# EAGLE design module (EAGLE 7.2.0)
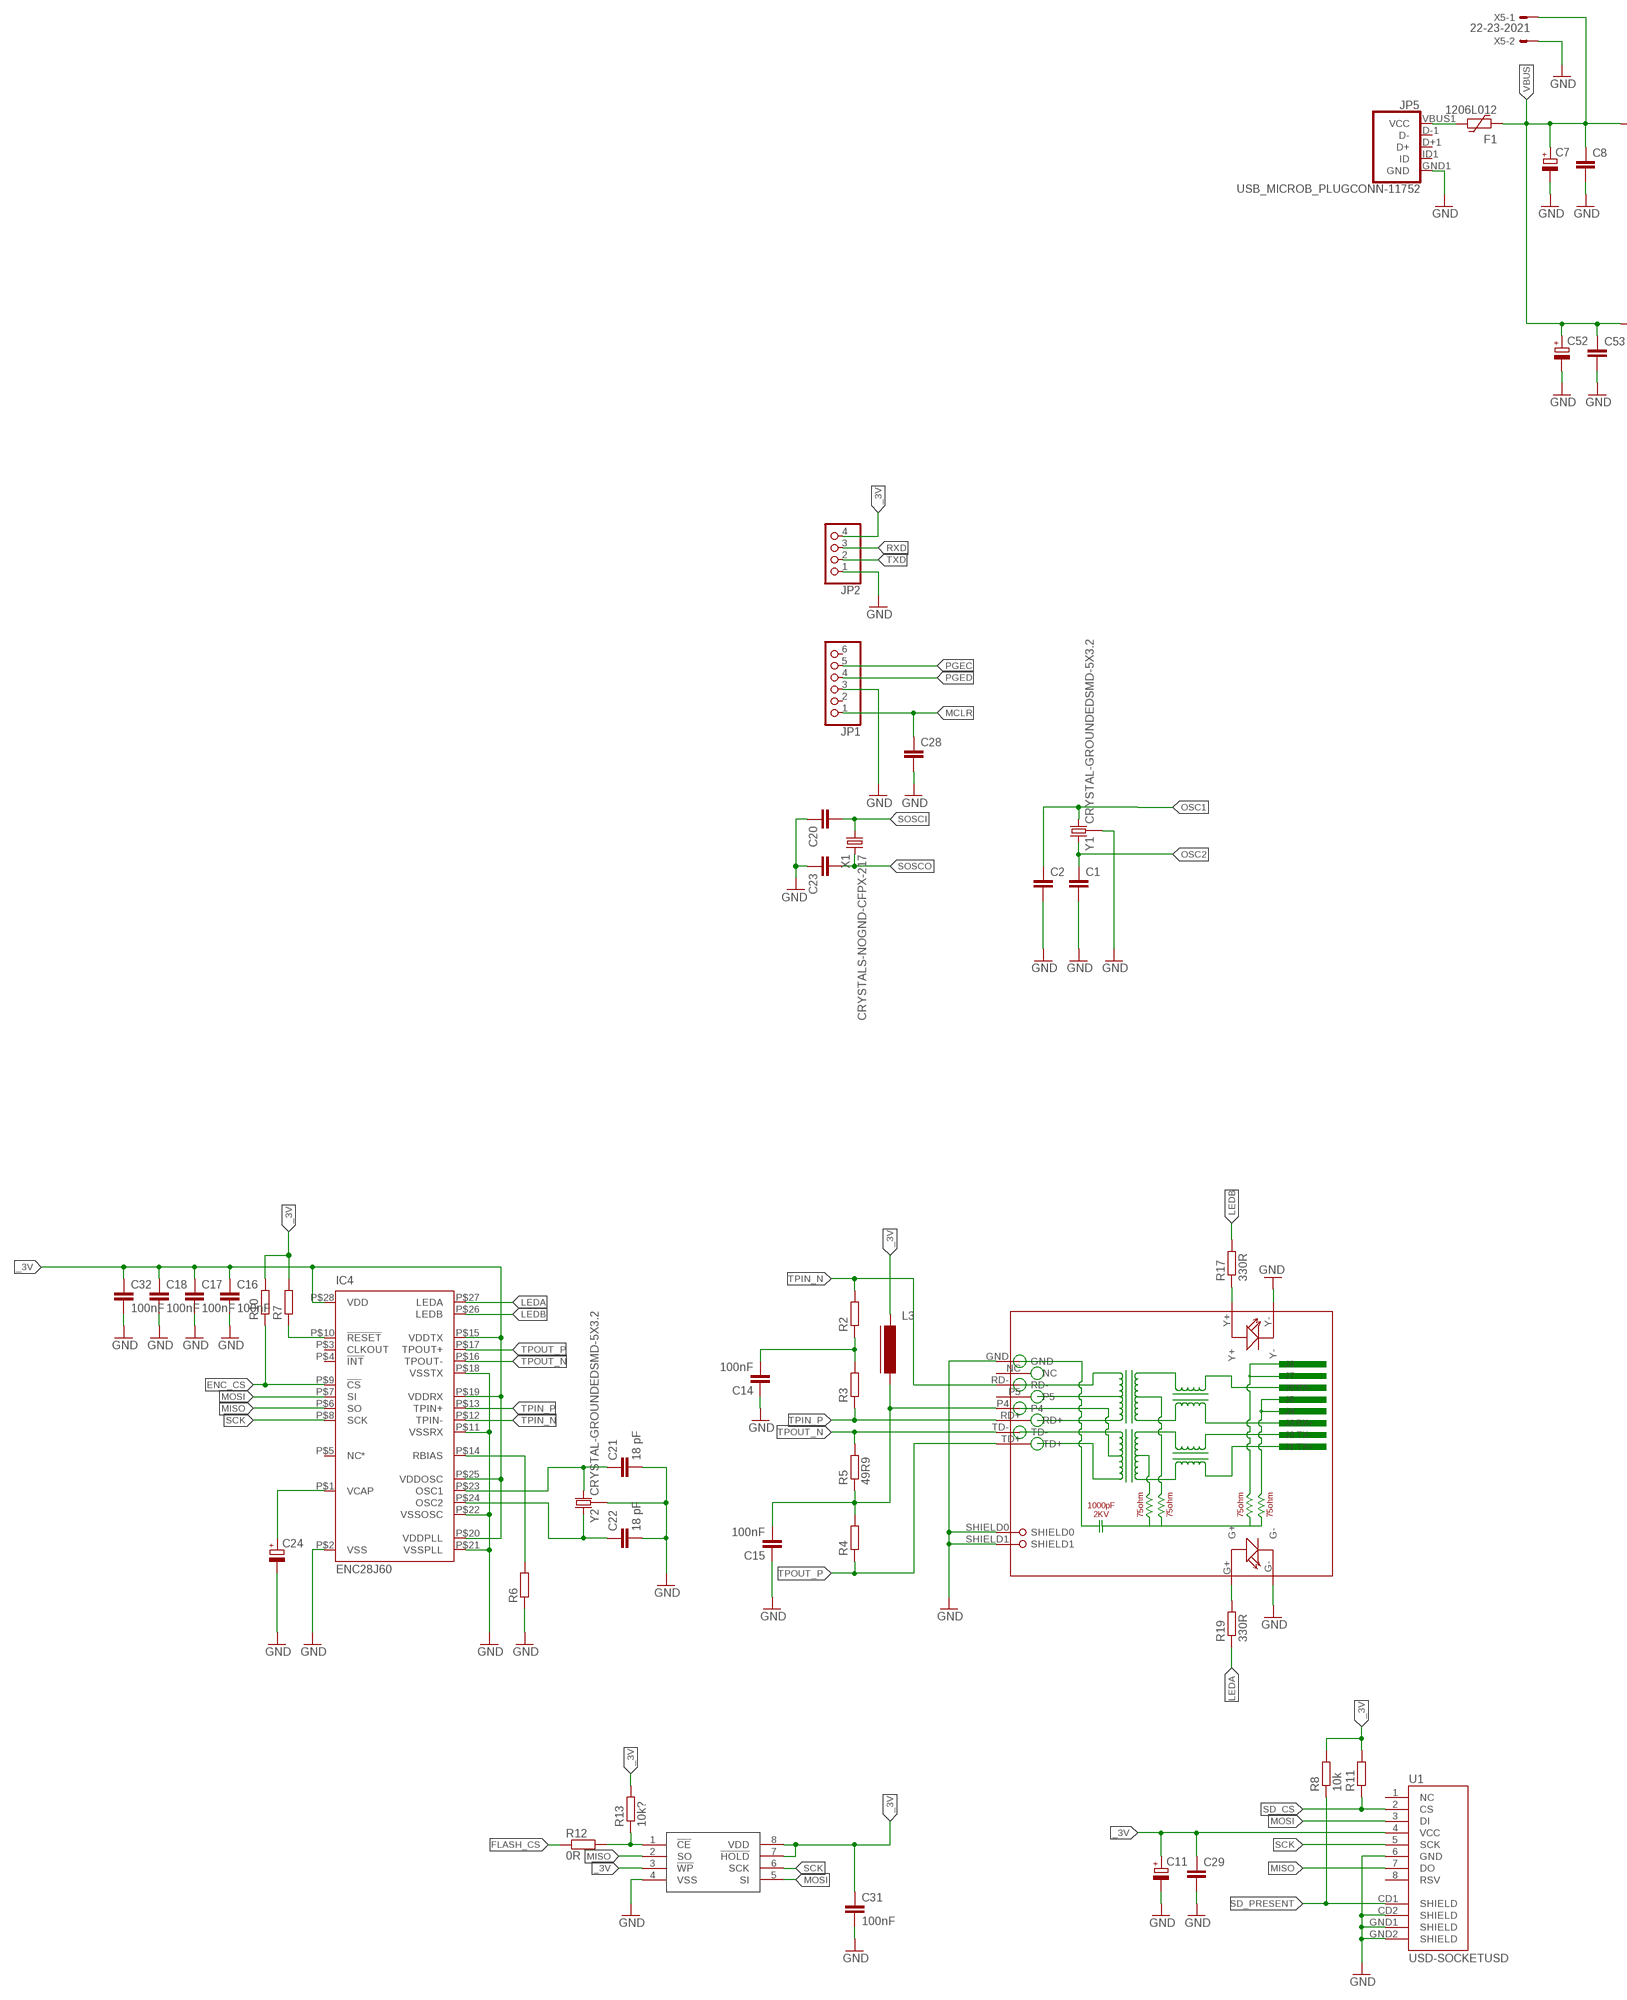
[diagram p0: schematic, sheet 1, part 1 of 3]
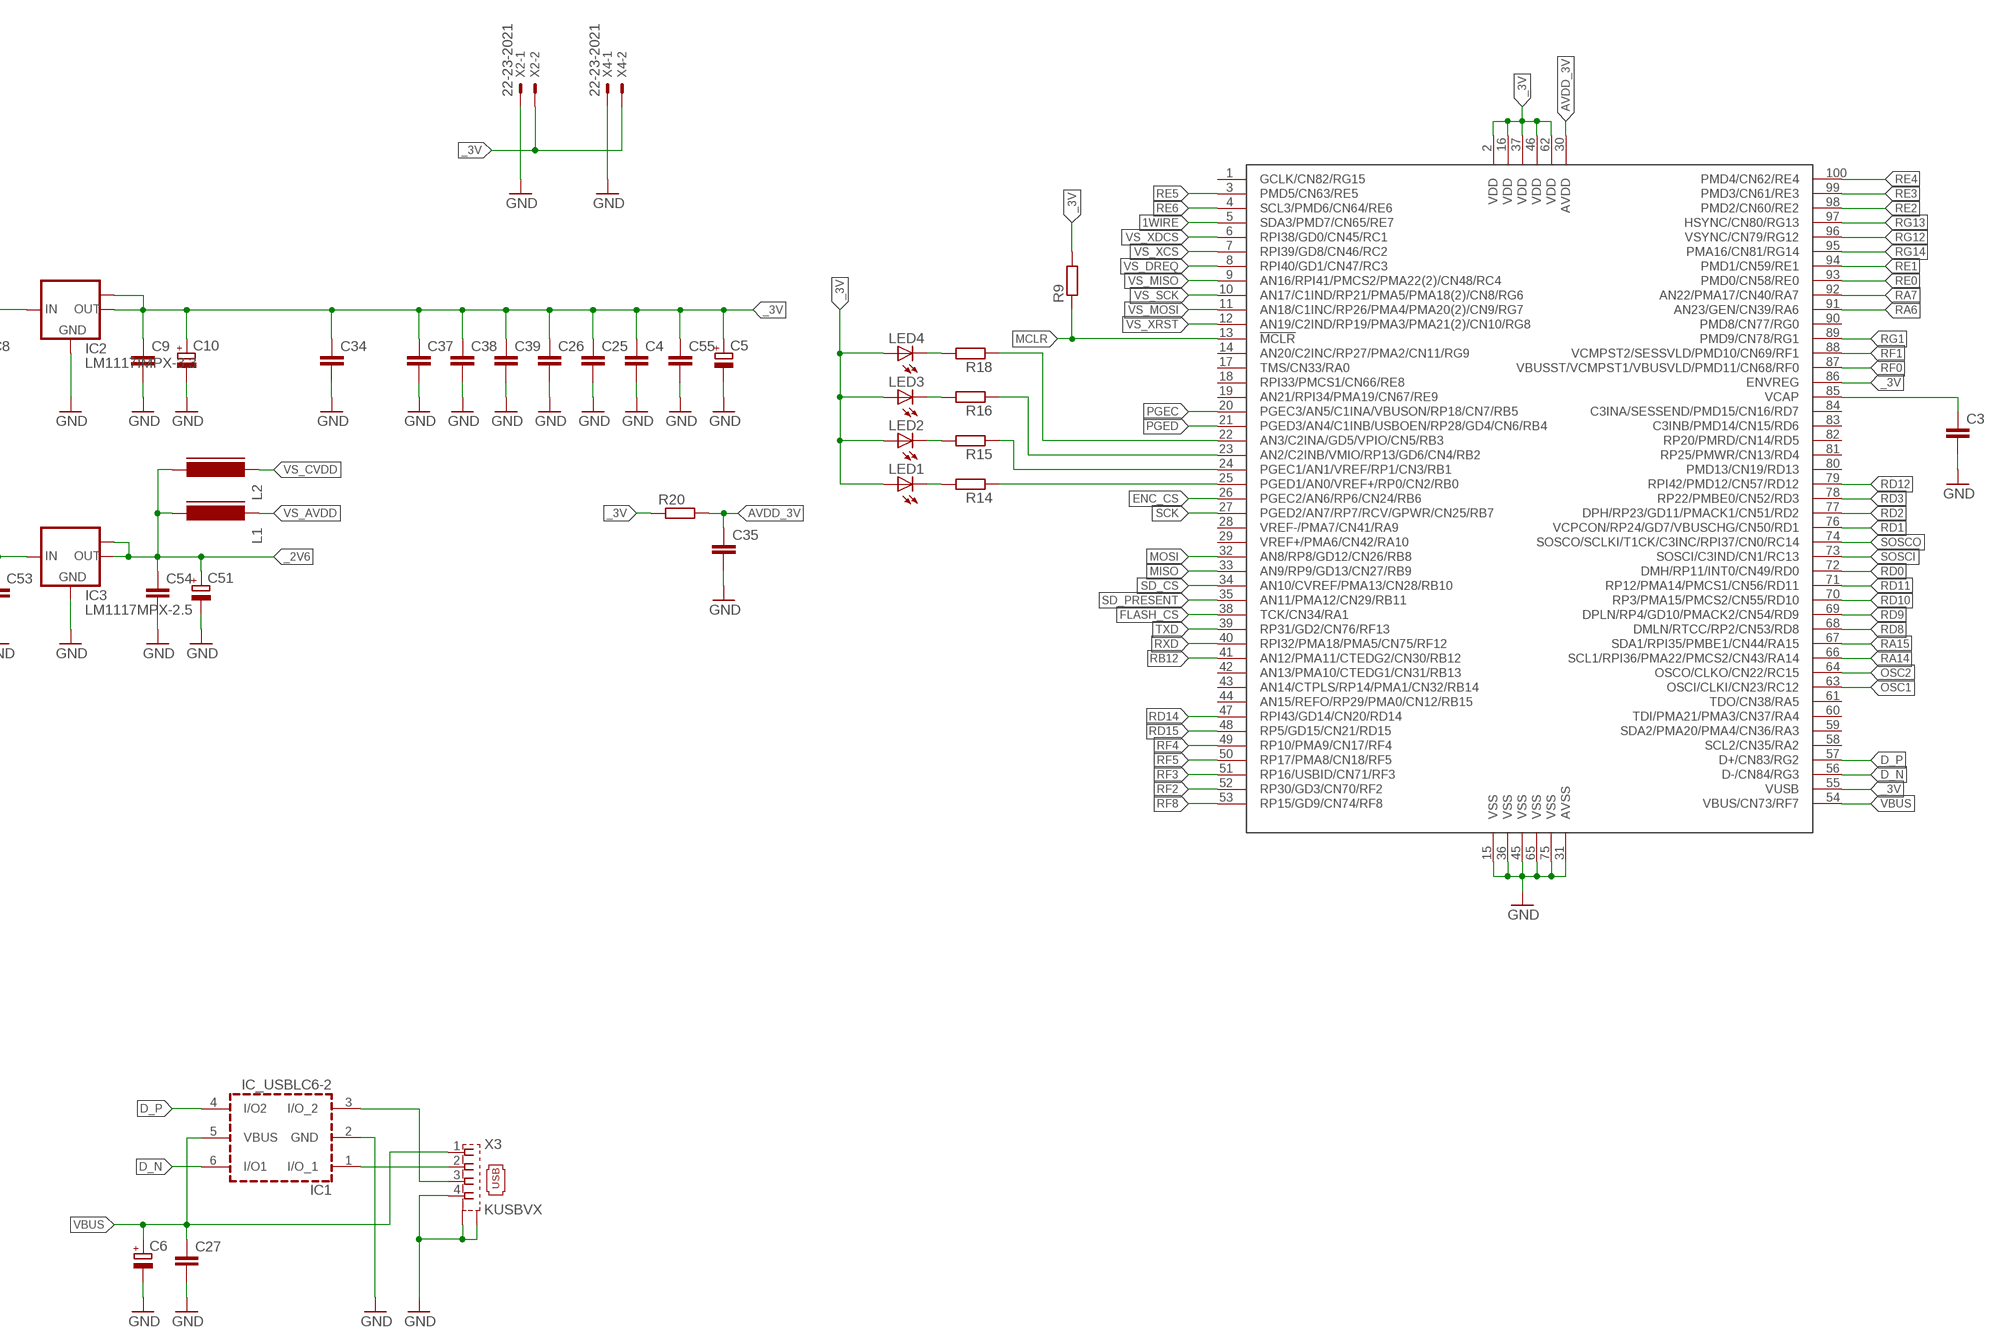
[diagram p1: schematic, sheet 1, part 2 of 3]
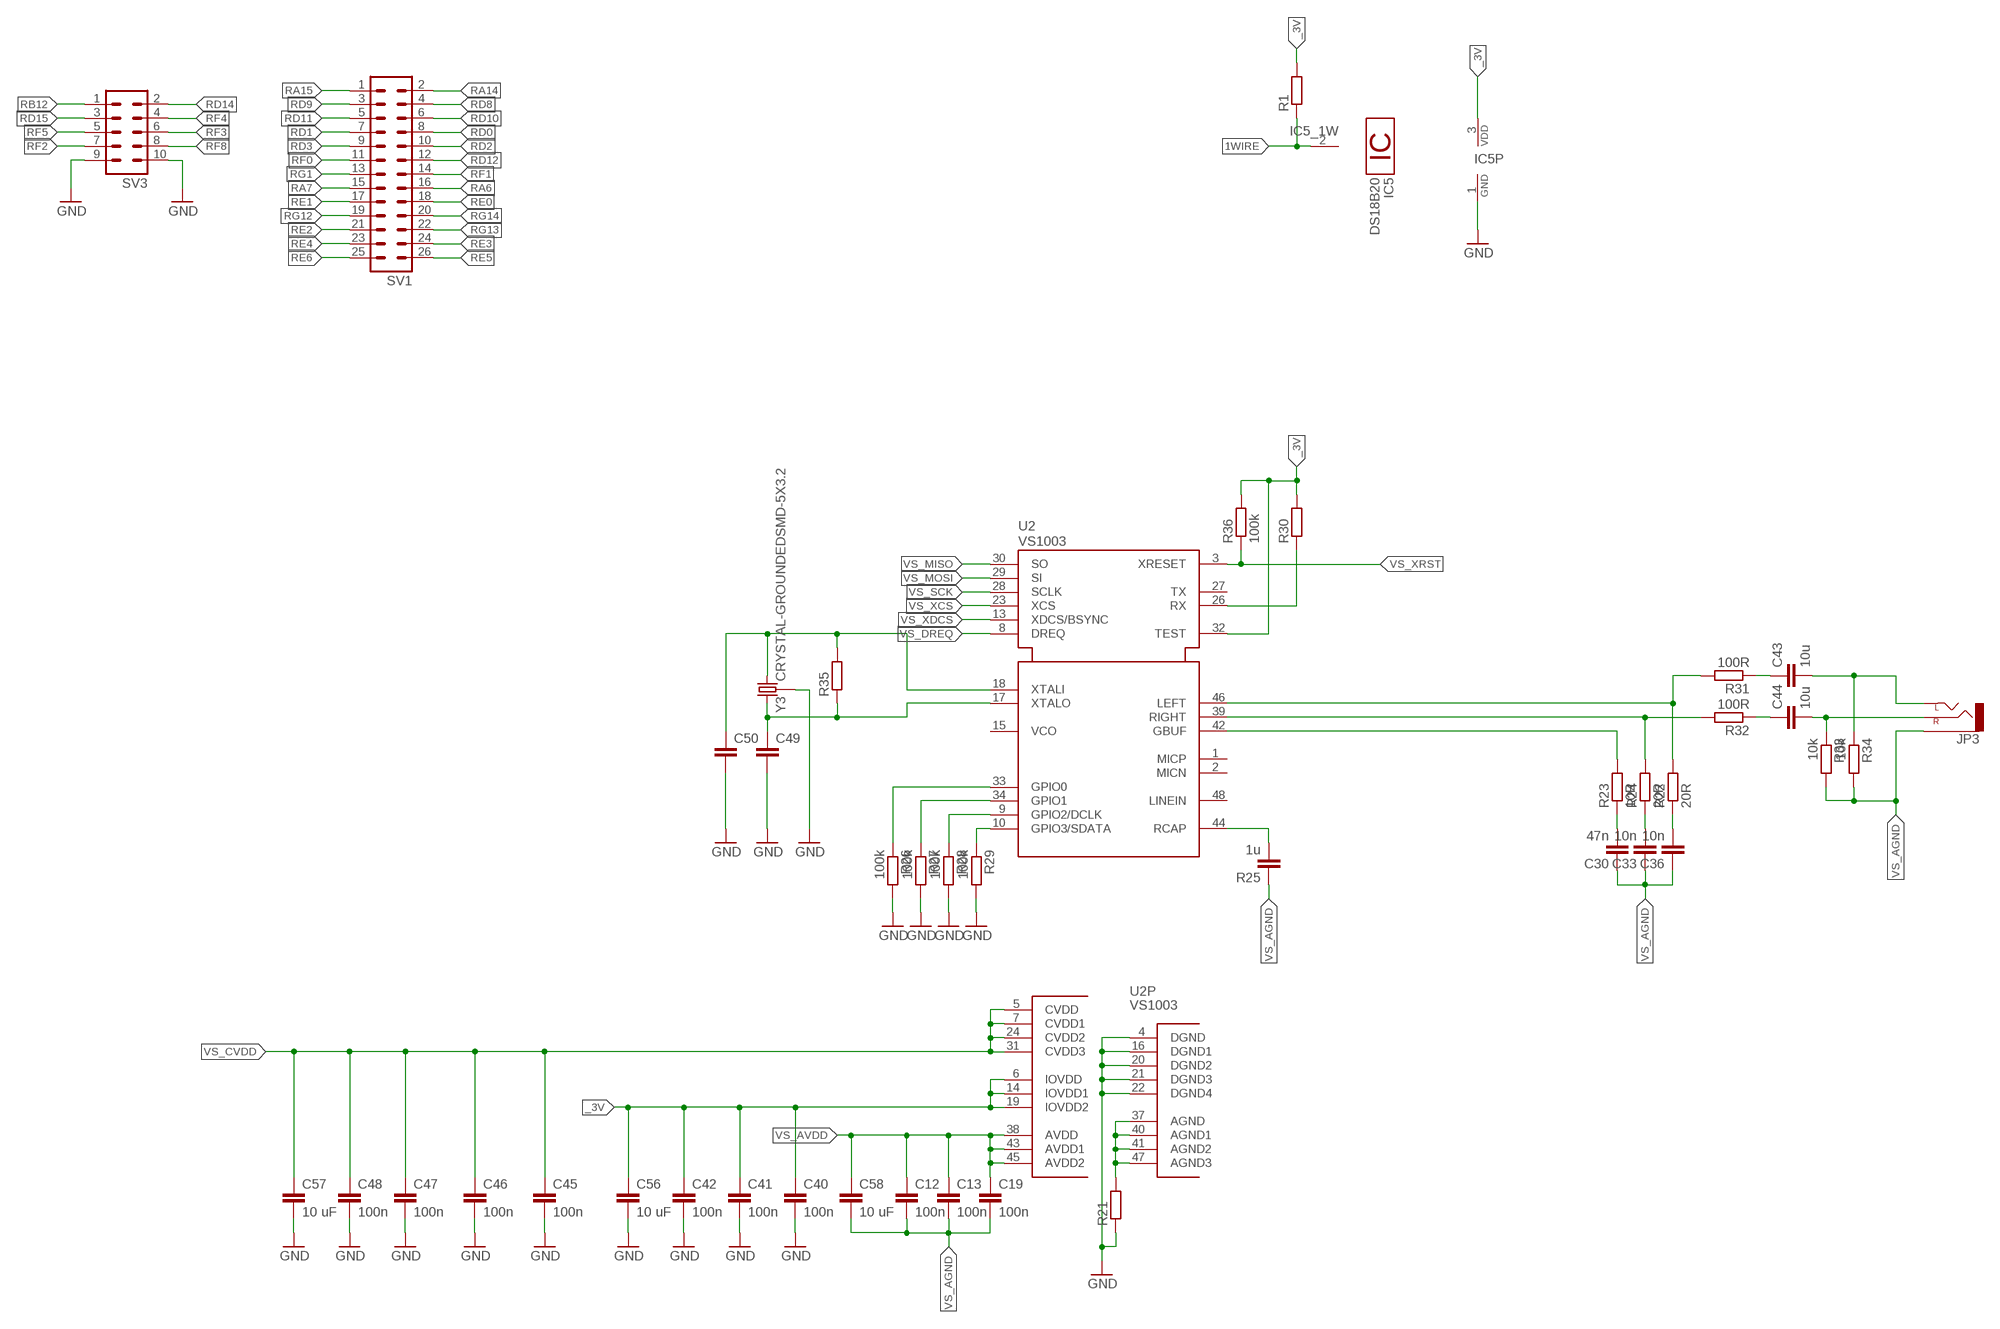
[diagram p2: schematic, sheet 1, part 3 of 3]

## Parts
C1  C-EUC0603  [C0603]
C2  C-EUC0603  [C0603]
C3  C-EUC0603  [C0603]
C4  C-EUC0402  [C0402]
C5  CPOL-EUSMCA  [SMC_A]
C6  CPOL-EUSMCB  [SMC_B]
C7  CPOL-EUSMCB  [SMC_B]
C8  C-EUC0603  [C0603]
C9  C-EUC0603  [C0603]
C10  CPOL-EUSMCB  [SMC_B]
C11  CPOL-EUSMCA  [SMC_A]
C12  100n  C-EUC0603  [C0603]
C13  100n  C-EUC0603  [C0603]
C14  100nF  C-EUC0603  [C0603]
C15  100nF  C-EUC0603  [C0603]
C16  100nF  C-EUC0402  [C0402]
C17  100nF  C-EUC0603  [C0603]
C18  100nF  C-EUC0603  [C0603]
C19  100n  C-EUC0603  [C0603]
C20  C-EUC0603  [C0603]
C21  18 pF  C-EUC0603  [C0603]
C22  18 pF  C-EUC0603  [C0603]
C23  C-EUC0603  [C0603]
C24  CPOL-EUSMCA  [SMC_A]
C25  C-EUC0402  [C0402]
C26  C-EUC0402  [C0402]
C27  C-EUC0805  [C0805]
C28  C-EUC0603  [C0603]
C29  C-EUC0603  [C0603]
C30  47n  C-EUC0603  [C0603]
C31  100nF  C-EUC0603  [C0603]
C32  100nF  C-EUC0402  [C0402]
C33  10n  C-EUC0603  [C0603]
C34  C-EUC0402  [C0402]
C35  C-EUC0402  [C0402]
C36  10n  C-EUC0603  [C0603]
C37  C-EUC0402  [C0402]
C38  C-EUC0603  [C0603]
C39  C-EUC0402  [C0402]
C40  100n  C-EUC0402  [C0402]
C41  100n  C-EUC0402  [C0402]
C42  100n  C-EUC0402  [C0402]
C43  10u  C-EUC0603  [C0603]
C44  10u  C-EUC0603  [C0603]
C45  100n  C-EUC0402  [C0402]
C46  100n  C-EUC0603  [C0603]
C47  100n  C-EUC0603  [C0603]
C48  100n  C-EUC0603  [C0603]
C49  C-EUC0603  [C0603]
C50  C-EUC0603  [C0603]
C51  CPOL-EUSMCC  [SMC_C]
C52  CPOL-EUSMCC  [SMC_C]
C53  C-EUC1206  [C1206]
C54  C-EUC1206  [C1206]
C55  C-EUC0603  [C0603]
C56  10 uF  C-EUC0603  [C0603]
C57  10 uF  C-EUC0603  [C0603]
C58  10 uF  C-EUC0603  [C0603]
F1  1206L012  [1206L]
IC1  IC_USBLC6-2  [SOT-23-6L]
IC2  LM1117IMPX-3.3  [SOT223]
IC3  LM1117MPX-2.5  [SOT223]
IC4  ENC28J60  [TSSOP28W]
IC5  DS18B20  [TO92-]
JP1  PINHD-1X6  [1X06]
JP2  PINHD-1X4  [1X04]
JP3  AUDIO-JACKAUDIO_JACK2  [AUDIO-JACK2]
JP5  USB_MICROB_PLUGCONN-11752  [USB-B-MICRO-SMD_V03]
L1  FERRITE-0805  [FB805]
L2  FERRITE-0805  [FB805]
L3  FERRITE-0805  [FB805]
LED1  LEDCHIP-LED0603  [CHIP-LED0603]
LED2  LEDCHIP-LED0603  [CHIP-LED0603]
LED3  LEDCHIP-LED0603  [CHIP-LED0603]
LED4  LEDCHIP-LED0603  [CHIP-LED0603]
R1  R-EU_R0603  [R0603]
R2  R-EU_R0603  [R0603]
R3  R-EU_R0603  [R0603]
R4  R-EU_R0603  [R0603]
R5  49R9  R-EU_R0603  [R0603]
R6  R-EU_R0805  [R0805]
R7  R-EU_R0603  [R0603]
R8  10k  R-EU_R0603  [R0603]
R9  R-EU_R0603  [R0603]
R10  R-EU_R0603  [R0603]
R11  R-EU_R0603  [R0603]
R12  0R  R-EU_R0603  [R0603]
R13  10k?  R-EU_R0603  [R0603]
R14  R-EU_R0603  [R0603]
R15  R-EU_R0603  [R0603]
R16  R-EU_R0603  [R0603]
R17  330R  R-EU_R1206  [R1206]
R18  R-EU_R0603  [R0603]
R19  330R  R-EU_R1206  [R1206]
R20  R-EU_R0805  [R0805]
R21  R-EU_R0603  [R0603]
R22  20R  R-EU_R0603  [R0603]
R23  10R  R-EU_R0603  [R0603]
R24  20R  R-EU_R0603  [R0603]
R25  1u  C-EUC0603  [C0603]
R26  100k  R-EU_R0402  [R0402]
R27  100k  R-EU_R0402  [R0402]
R28  100k  R-EU_R0402  [R0402]
R29  100k  R-EU_R0402  [R0402]
R30  R-EU_0204/7  [0204/7]
R31  100R  R-EU_R0603  [R0603]
R32  100R  R-EU_R0603  [R0603]
R33  10k  R-EU_R0603  [R0603]
R34  10k  R-EU_R0603  [R0603]
R35  R-EU_R0603  [R0603]
R36  100k  R-EU_R0603  [R0603]
RJ1  HR911105A  [HR911105A]
SV1  ML26L  [ML26L]
SV3  ML10L  [ML10L]
U1  USD-SOCKETUSD  [USD-SOCKET-PP]
U2  VS1003  [LQFP48]
U$1  PIC24FJ256DA210SMALL  [TQFP100-12X12]
U$2  SST25VF016BSO8M  [SO-08M]
X1  CRYSTALS-NOGND-CFPX-217  [3.2X1.5-2-PAD]
X2  22-23-2021  [22-23-2021]
X3  KUSBVX  [KUSBVX]
X4  22-23-2021  [22-23-2021]
X5  22-23-2021  [22-23-2021]
Y1  CRYSTAL-GROUNDEDSMD-5X3.2  [CRYSTAL-SMD-5X3.2-4PAD]
Y2  CRYSTAL-GROUNDEDSMD-5X3.2  [CRYSTAL-SMD-5X3.2-4PAD]
Y3  CRYSTAL-GROUNDEDSMD-5X3.2  [CRYSTAL-SMD-5X3.2-4PAD]

## Nets
1WIRE: IC5.2 R1.1 U$1.5(SDA3/PMD7/CN65/RE7)
_2V6: C51.+ C54.1 IC3.2(OUT) IC3.TAB(OUT1) L1.2 L2.2
_3V: C4.1 C5.+ C9.1 C10.+ C11.+ C16.1 C17.1 C18.1 C25.1 C26.1 C29.1 C31.1 C32.1 C34.1 C37.1 C38.1 C39.1 C40.1 C41.1 C42.1 C55.1 C56.1 IC2.2(OUT) IC2.TAB(OUT1) IC4.P$15(VDDTX) IC4.P$19(VDDRX) IC4.P$20(VDDPLL) IC4.P$25(VDDOSC) IC4.P$28(VDD) IC5.3 JP2.4 L3.1 LED1.A LED2.A LED3.A LED4.A R1.2 R7.2 R8.2 R9.2 R10.2 R11.2 R13.2 R20.1 R30.2 R36.2 U1.4(VCC) U2.6(IOVDD) U2.14(IOVDD1) U2.19(IOVDD2) U2.32(TEST) U$1.2(VDD) U$1.16(VDD) U$1.37(VDD) U$1.46(VDD) U$1.55(VUSB) U$1.62(VDD) U$1.86(ENVREG) U$2.3(!WP) U$2.7(!HOLD) U$2.8(VDD) X2.2 X4.2
AVDD_3V: C35.1 R20.2 U$1.30(AVDD)
CE1: R12.2 R13.1 U$2.1(!CE)
D2_N: IC1.1(I/O_1) X3.2
D2_P: IC1.3(I/O_2) X3.3
D_N: IC1.6(I/O1) U$1.56(D-/CN84/RG3)
D_P: IC1.4(I/O2) U$1.57(D+/CN83/RG2)
ENC_CS: IC4.P$9(!CS) R10.1 U$1.26(PGEC2/AN6/RP6/CN24/RB6)
ENC_RST: IC4.P$10(!RESET) R7.1
FLASH_CS: R12.1 U$1.38(TCK/CN34/RA1)
GND: C1.2 C2.2 C3.2 C4.2 C5.- C6.- C7.- C8.2 C9.2 C10.- C11.- C14.1 C15.1 C16.2 C17.2 C18.2 C20.1 C21.2 C22.2 C23.1 C24.- C25.2 C26.2 C27.2 C28.2 C29.2 C31.2 C32.2 C34.2 C35.2 C37.2 C38.2 C39.2 C40.2 C41.2 C42.2 C45.2 C46.2 C47.2 C48.2 C49.2 C50.2 C51.- C52.- C53.2 C54.2 C55.2 C56.2 C57.2 IC1.2(GND) IC2.1(GND) IC3.1(GND) IC4.P$2(VSS) IC4.P$11(VSSRX) IC4.P$18(VSSTX) IC4.P$21(VSSPLL) IC4.P$22(VSSOSC) IC5.1 JP1.3 JP2.1 JP5.GND1(GND) R6.1 R21.1 R26.2 R27.2 R28.2 R29.2 RJ1.G- RJ1.GND RJ1.SHIELD0 RJ1.SHIELD1 RJ1.Y- SV3.9 SV3.10 U1.6(GND) U1.CD2(SHIELD) U1.GND1(SHIELD) U1.GND2(SHIELD) U2.4(DGND) U2.16(DGND1) U2.20(DGND2) U2.21(DGND3) U2.22(DGND4) U$1.15(VSS) U$1.31(AVSS) U$1.36(VSS) U$1.45(VSS) U$1.65(VSS) U$1.75(VSS) U$2.4(VSS) X2.1 X3.4 X3.M1(S1) X3.M2(S2) X4.1 X5.2 Y1.2 Y1.4 Y2.2 Y2.4 Y3.2 Y3.4
LEDA: IC4.P$27(LEDA) R19.1
LEDB: IC4.P$26(LEDB) R17.2
MCLR: C28.1 JP1.1 R9.1 U$1.13(!MCLR)
MISO: IC4.P$6(SO) U1.7(DO) U$1.33(AN9/RP9/GD13/CN27/RB9) U$2.2(SO)
MOSI: IC4.P$7(SI) U1.3(DI) U$1.32(AN8/RP8/GD12/CN26/RB8) U$2.5(SI)
N$1: C3.1 U$1.85(VCAP)
N$2: C14.2 R2.1 R3.2
N$3: LED1.C R14.2
N$5: LED2.C R15.2
N$6: C15.2 L3.2 R4.2 R5.1 RJ1.P4
N$8: LED3.C R16.2
N$10: LED4.C R18.2
N$12: IC4.P$14(RBIAS) R6.2
N$17: F1.1 JP5.VBUS1(VCC)
N$18: C30.2 R23.1
N$22: C21.1 IC4.P$23(OSC1) Y2.1
N$23: C22.1 IC4.P$24(OSC2) Y2.3
N$29: C24.+ IC4.P$1(VCAP)
N$30: R17.1 RJ1.Y+
N$31: R19.2 RJ1.G+
OSC1: C2.1 U$1.63(OSCI/CLKI/CN23/RC12) Y1.1
OSC2: C1.1 U$1.64(OSCO/CLKO/CN22/RC15) Y1.3
PGEC: JP1.5 U$1.20(PGEC3/AN5/C1INA/VBUSON/RP18/CN7/RB5)
PGED: JP1.4 U$1.21(PGED3/AN4/C1INB/USBOEN/RP28/GD4/CN6/RB4)
RA6: SV1.16 U$1.91(AN23/GEN/CN39/RA6)
RA7: SV1.15 U$1.92(AN22/PMA17/CN40/RA7)
RA14: SV1.2 U$1.66(SCL1/RPI36/PMA22/PMCS2/CN43/RA14)
RA15: SV1.1 U$1.67(SDA1/RPI35/PMBE1/CN44/RA15)
RB0: R14.1 U$1.25(PGED1/AN0/VREF+/RP0/CN2/RB0)
RB1: R15.1 U$1.24(PGEC1/AN1/VREF/RP1/CN3/RB1)
RB2: R16.1 U$1.23(AN2/C2INB/VMIO/RP13/GD6/CN4/RB2)
RB3: R18.1 U$1.22(AN3/C2INA/GD5/VPIO/CN5/RB3)
RB12: SV3.1 U$1.41(AN12/PMA11/CTEDG2/CN30/RB12)
RD0: SV1.8 U$1.72(DMH/RP11/INT0/CN49/RD0)
RD1: SV1.7 U$1.76(VCPCON/RP24/GD7/VBUSCHG/CN50/RD1)
RD2: SV1.10 U$1.77(DPH/RP23/GD11/PMACK1/CN51/RD2)
RD3: SV1.9 U$1.78(RP22/PMBE0/CN52/RD3)
RD8: SV1.4 U$1.68(DMLN/RTCC/RP2/CN53/RD8)
RD9: SV1.3 U$1.69(DPLN/RP4/GD10/PMACK2/CN54/RD9)
RD10: SV1.6 U$1.70(RP3/PMA15/PMCS2/CN55/RD10)
RD11: SV1.5 U$1.71(RP12/PMA14/PMCS1/CN56/RD11)
RD12: SV1.12 U$1.79(RPI42/PMD12/CN57/RD12)
RD14: SV3.2 U$1.47(RPI43/GD14/CN20/RD14)
RD15: SV3.3 U$1.48(RP5/GD15/CN21/RD15)
RE0: SV1.18 U$1.93(PMD0/CN58/RE0)
RE1: SV1.17 U$1.94(PMD1/CN59/RE1)
RE2: SV1.21 U$1.98(PMD2/CN60/RE2)
RE3: SV1.24 U$1.99(PMD3/CN61/RE3)
RE4: SV1.23 U$1.100(PMD4/CN62/RE4)
RE5: SV1.26 U$1.3(PMD5/CN63/RE5)
RE6: SV1.25 U$1.4(SCL3/PMD6/CN64/RE6)
RF0: SV1.11 U$1.87(VBUSST/VCMPST1/VBUSVLD/PMD11/CN68/RF0)
RF1: SV1.14 U$1.88(VCMPST2/SESSVLD/PMD10/CN69/RF1)
RF2: SV3.7 U$1.52(RP30/GD3/CN70/RF2)
RF3: SV3.6 U$1.51(RP16/USBID/CN71/RF3)
RF4: SV3.4 U$1.49(RP10/PMA9/CN17/RF4)
RF5: SV3.5 U$1.50(RP17/PMA8/CN18/RF5)
RF8: SV3.8 U$1.53(RP15/GD9/CN74/RF8)
RG1: SV1.13 U$1.89(PMD9/CN78/RG1)
RG12: SV1.19 U$1.96(VSYNC/CN79/RG12)
RG13: SV1.22 U$1.97(HSYNC/CN80/RG13)
RG14: SV1.20 U$1.95(PMA16/CN81/RG14)
RXD: JP2.3 U$1.40(RPI32/PMA18/PMA5/CN75/RF12)
SCK: IC4.P$8(SCK) U1.5(SCK) U$1.27(PGED2/AN7/RP7/RCV/GPWR/CN25/RB7) U$2.6(SCK)
SD_CS: R11.1 U1.2(CS) U$1.34(AN10/CVREF/PMA13/CN28/RB10)
SD_PRESENT: R8.1 U1.CD1(SHIELD) U$1.35(AN11/PMA12/CN29/RB11)
SOSCI: C20.2 U$1.73(SOSCI/C3IND/CN1/RC13) X1.1
SOSCO: C23.2 U$1.74(SOSCO/SCLKI/T1CK/C3INC/RPI37/CN0/RC14) X1.2
TPIN_N: IC4.P$12(TPIN-) R2.2 RJ1.RD-
TPIN_P: IC4.P$13(TPIN+) R3.1 RJ1.RD+
TPOUT_N: IC4.P$16(TPOUT-) R5.2 RJ1.TD-
TPOUT_P: IC4.P$17(TPOUT+) R4.1 RJ1.TD+
TXD: JP2.2 U$1.39(RP31/GD2/CN76/RF13)
VBUS: C6.+ C7.+ C8.1 C27.1 C52.+ C53.1 F1.2 IC1.5(VBUS) IC2.3(IN) IC3.3(IN) U$1.54(VBUS/CN73/RF7) X3.1 X5.1
VS_AGND: C12.2 C13.2 C19.2 C30.1 C33.1 C36.1 C58.2 JP3.SLEEVE R21.2 R25.1 R33.2 R34.2 U2.37(AGND) U2.40(AGND1) U2.41(AGND2) U2.47(AGND3)
VS_AVDD: C12.1 C13.1 C19.1 C58.1 L1.1 U2.38(AVDD) U2.43(AVDD1) U2.45(AVDD2)
VS_CVDD: C45.1 C46.1 C47.1 C48.1 C57.1 L2.1 U2.5(CVDD) U2.7(CVDD1) U2.24(CVDD2) U2.31(CVDD3)
VS_DREQ: U2.8(DREQ) U$1.8(RPI40/GD1/CN47/RC3)
VS_MISO: U2.30(SO) U$1.9(AN16/RPI41/PMCS2/PMA22(2)/CN48/RC4)
VS_MOSI: U2.29(SI) U$1.11(AN18/C1INC/RP26/PMA4/PMA20(2)/CN9/RG7)
VS_N$9: C50.1 R35.2 U2.18(XTALI) Y3.1
VS_N$13: C49.1 R35.1 U2.17(XTALO) Y3.3
VS_N$14: R22.2 R31.2 U2.46(LEFT)
VS_N$15: R23.2 U2.42(GBUF)
VS_N$16: R24.2 R32.2 U2.39(RIGHT)
VS_N$17: R25.2 U2.44(RCAP)
VS_N$24: C33.2 R24.1
VS_N$25: C36.2 R22.1
VS_N$26: R29.1 U2.10(GPIO3/SDATA)
VS_N$27: R28.1 U2.9(GPIO2/DCLK)
VS_N$28: R27.1 U2.34(GPIO1)
VS_N$30: R26.1 U2.33(GPIO0)
VS_N$34: R30.1 U2.26(RX)
VS_N$35: C43.1 R31.1
VS_N$36: C44.1 R32.1
VS_N$37: C44.2 JP3.RING(RIGHT) R33.1
VS_N$38: C43.2 JP3.TIP(LEFT) R34.1
VS_SCK: U2.28(SCLK) U$1.10(AN17/C1IND/RP21/PMA5/PMA18(2)/CN8/RG6)
VS_XCS: U2.23(XCS) U$1.7(RPI39/GD8/CN46/RC2)
VS_XDCS: U2.13(XDCS/BSYNC) U$1.6(RPI38/GD0/CN45/RC1)
VS_XRST: R36.1 U2.3(XRESET) U$1.12(AN19/C2IND/RP19/PMA3/PMA21(2)/CN10/RG8)
Unconnected: IC4.P$3(CLKOUT) IC4.P$4(!INT) IC4.P$5(NC*) JP1.2 JP1.6 JP5.D+1(D+) JP5.D-1(D-) JP5.ID1(ID) RJ1.NC RJ1.P5 U1.1(NC) U1.8(RSV) U2.1(MICP) U2.2(MICN) U2.15(VCO) U2.27(TX) U2.48(LINEIN) U$1.1(GCLK/CN82/RG15) U$1.14(AN20/C2INC/RP27/PMA2/CN11/RG9) U$1.17(TMS/CN33/RA0) U$1.18(RPI33/PMCS1/CN66/RE8) U$1.19(AN21/RPI34/PMA19/CN67/RE9) U$1.28(VREF-/PMA7/CN41/RA9) U$1.29(VREF+/PMA6/CN42/RA10) U$1.42(AN13/PMA10/CTEDG1/CN31/RB13) U$1.43(AN14/CTPLS/RP14/PMA1/CN32/RB14) U$1.44(AN15/REFO/RP29/PMA0/CN12/RB15) U$1.58(SCL2/CN35/RA2) U$1.59(SDA2/PMA20/PMA4/CN36/RA3) U$1.60(TDI/PMA21/PMA3/CN37/RA4) U$1.61(TDO/CN38/RA5) U$1.80(PMD13/CN19/RD13) U$1.81(RP25/PMWR/CN13/RD4) U$1.82(RP20/PMRD/CN14/RD5) U$1.83(C3INB/PMD14/CN15/RD6) U$1.84(C3INA/SESSEND/PMD15/CN16/RD7) U$1.90(PMD8/CN77/RG0)

## Library data of the parts
C1-C4 C8 C9 C12-C23 C25-C50 C53-C58 R25 = rcl:C-EU: CAPACITOR, European symbol
C5-C7 C10 C11 C24 C51 C52 = rcl:CPOL-EU: POLARIZED CAPACITOR, European symbol
F1 = polyfuse-smd_10:?: Polyfuse Resettable PTC Source: http://www.littelfuse.com/products/resettable-ptcs.aspx; MF: Littelfuse; MPN: 1206L012; OC_FARNELL: 1596988; OC_NEWARK: 05M2298
IC1 = dp_devices:IC_USBLC6-2
IC2 = lm1117:LM1117IMPX-*
IC3 = lm1117:LM1117MPX-*
IC4 = microchip:ENC28J60: Stand-Alone Ethernet Controller with SPI Interface Source: http://ww1.microchip.com/downloads/en/DeviceDoc/39662c.pdf
IC5 = 1wire:DS18B20: Programmable Resolution Digital Thermometer This chip provides a onewire thermosensor with approx. 0.5°C accuracy. A programmable over/undertemperure alarm is available. The precision can be set from 9..12 bits. Notes: Vdd must be applied for accurate measurements at low temperatures, as the parasite power circuit otherwise heats the sensor. If parasite power is used, Vdd has to be connected to GND. The DS1822 is a low-cost thermometer chip, the DS18S20 is similar to the DS18B20, but with 9 Bit precision only. Author: Jan Kandziora <jjj@gmx.de>
JP1 = pinhead:PINHD-1X6: PIN HEADER
JP2 = pinhead:PINHD-1X4: PIN HEADER
JP3 = SparkFun-Connectors:AUDIO-JACK: 3.5mm Audio Jack Simple 3.5mm common PCB mount audio jack. SKU: PRT-08032
JP5 = SparkFun-Connectors:USB_MICROB_PLUG: USB Micro-B connectors Some male, some female. Watch your step!; PROD_ID: CONN-11752
L1-L3 = dp_devices:FERRITE: Ferrite bead in various packages
LED1-LED4 = led:LED: LED OSRAM: - CHIPLED LG R971, LG N971, LY N971, LG Q971, LY Q971, LO R971, LY R971 LH N974, LH R974 LS Q976, LO Q976, LY Q976 LO Q996 - Hyper CHIPLED LW Q18S LB Q993, LB Q99A, LB R99A - SideLED LS A670, LO A670, LY A670, LG A670, LP A670 LB A673, LV A673, LT A673, LW A673 LH A674 LY A675 LS A676, LA A676, LO A676, LY A676, LW A676 LS A679, LY A679, LG A679 - Hyper Micro SIDELED® LS Y876, LA Y876, LO Y876, LY Y876 LT Y87S - SmartLED LW L88C, LW L88S LB L89C, LB L89S, LG L890 LS L89K, LO L89K, LY L89K LS L896, LA L896, LO L896, LY L896 - TOPLED LS T670, LO T670, LY T670, LG T670, LP T670 LSG T670, LSP T670, LSY T670, LOP T670, LYG T670 LG T671, LOG T671, LSG T671 LB T673, LV T673, LT T673, LW T673 LH T674 LS T676, LA T676, LO T676, LY T676, LB T676, LH T676, LSB T676, LW T676 LB T67C, LV T67C, LT T67C, LS T67K, LO T67K, LY T67K, LW E67C LS E67B, LA E67B, LO E67B, LY E67B, LB E67C, LV E67C, LT E67C LW T67C LS T679, LY T679, LG T679 LS T770, LO T770, LY T770, LG T770, LP T770 LB T773, LV T773, LT T773, LW T773 LH T774 LS E675, LA E675, LY E675, LS T675 LS T776, LA T776, LO T776, LY T776, LB T776 LHGB T686 LT T68C, LB T68C - Hyper Mini TOPLED® LB M676 - Mini TOPLED Santana® LG M470 LS M47K, LO M47K, LY M47K Source: http://www.osram.convergy.de LUXEON: - LUMILED® LXK2-PW12-R00, LXK2-PW12-S00, LXK2-PW14-U00, LXK2-PW14-V00 LXK2-PM12-R00, LXK2-PM12-S00, LXK2-PM14-U00 LXK2-PE12-Q00, LXK2-PE12-R00, LXK2-PE12-S00, LXK2-PE14-T00, LXK2-PE14-U00 LXK2-PB12-K00, LXK2-PB12-L00, LXK2-PB12-M00, LXK2-PB14-N00, LXK2-PB14-P00, LXK2-PB14-Q00 LXK2-PR12-L00, LXK2-PR12-M00, LXK2-PR14-Q00, LXK2-PR14-R00 LXK2-PD12-Q00, LXK2-PD12-R00, LXK2-PD12-S00 LXK2-PH12-R00, LXK2-PH12-S00 LXK2-PL12-P00, LXK2-PL12-Q00, LXK2-PL12-R00 Source: www.luxeon.com KINGBRIGHT: KA-3528ASYC Source: www.kingbright.com
R1-R24 R26-R36 = rcl:R-EU_: RESISTOR, European symbol
RJ1 = hanrun:HR911105A
SV1 = con-harting-ml:ML26: HARTING; OC_FARNELL: unknown; OC_NEWARK: unknown
SV3 = con-harting-ml:ML10: HARTING; OC_FARNELL: unknown; OC_NEWARK: unknown
U1 = SparkFun-Connectors:USD-SOCKET: microSD Socket Push-push type uSD socket. Schematic element and footprint production proven. Spark Fun Electronics SKU : PRT-00127. tDoc lines correctly indicate media card edge positions when inserting (unlocked, locked, depressed).
U2 = vlsi-web:VS1003: MP3 / WMA / MIDI Audio Codec Circuit
U$1 = mw:PIC24FJ256DA210
U$2 = mw:SST25VF016B
X1 = IQD-Frequency-Products:CRYSTALS-NOGND: CRYSTALS CAN NOT GROUNDED
X2 X4 X5 = con-molex:22-23-2021: .100" (2.54mm) Center Header - 2 Pin; MF: MOLEX; MPN: 22-23-2021; OC_FARNELL: 1462926; OC_NEWARK: 25C3832
X3 = con-kycon:KUSBVX: Vertical,Top Entry Universal Serial Bus Connector KUSBVX Series Source: KYCON Sibalco USB vertical socket KUSBV.pdf
Y1-Y3 = SparkFun-Clocks:CRYSTAL-GROUNDED: Crystals w/ Ground Pin (Generic) These are passive quartz crystals, which can be used as a clock source for a microcontroller. Crystal's are usually two-terminal devices. A third terminal may be optionally connected to ground, as recommended by the manufaturer.

## Board
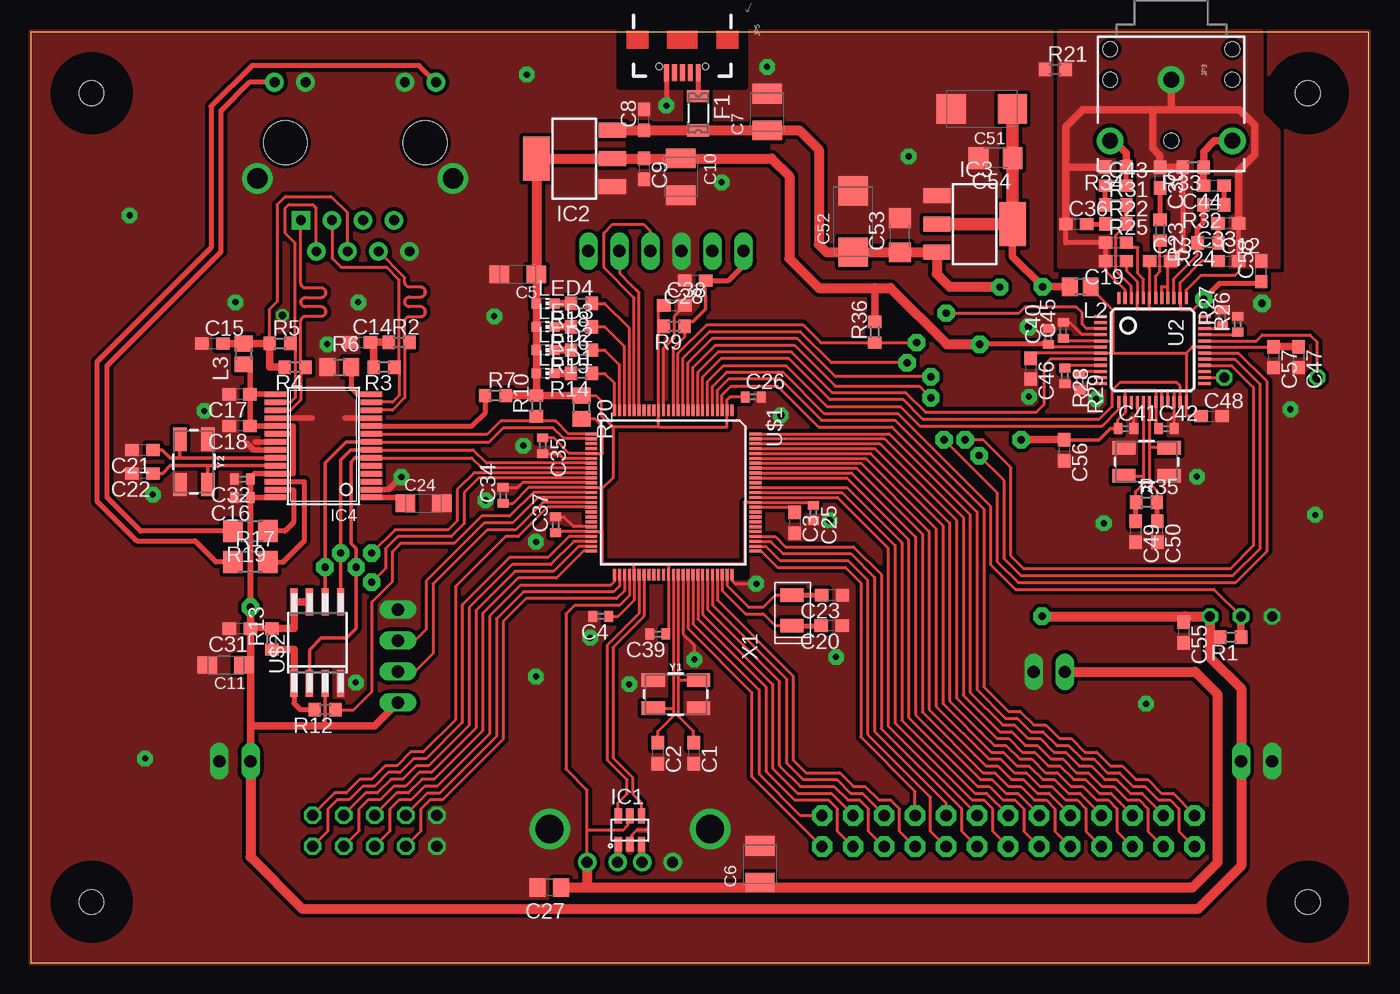
[diagram p3: board, top side]
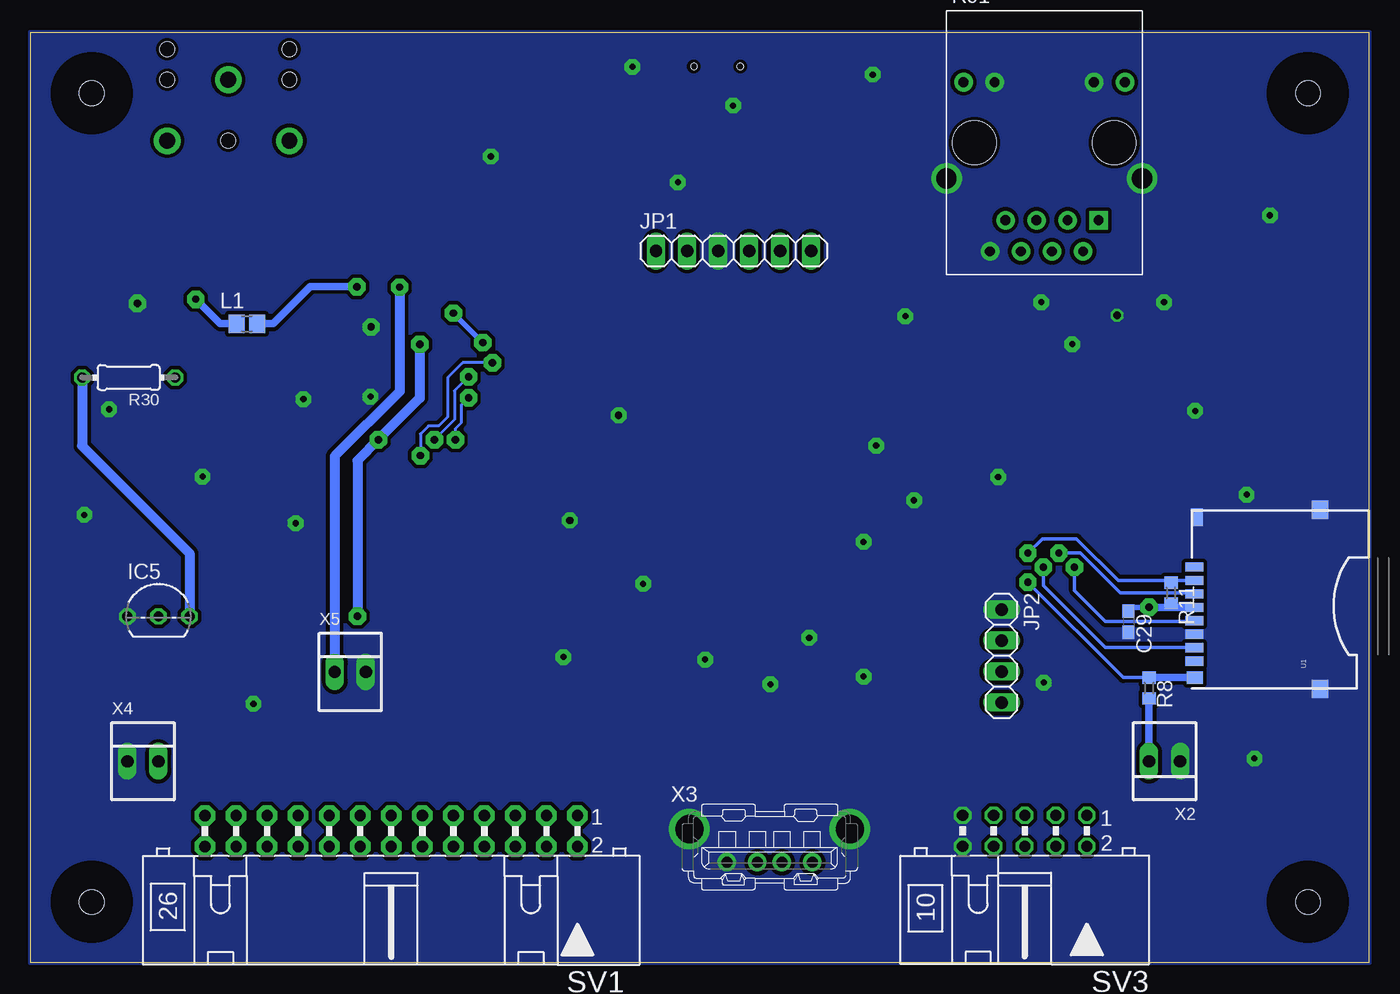
[diagram p4: board, bottom side, seen from below]

Size 109.52 x 76.19 mm. Coordinates in mm from the lower left corner, seen from the top.
Outline: 0,0 109.52,0 109.52,76.19 0,76.19 0,0
Copper layers (1*16): Top 0.035mm / dielectric 1.5mm / Bottom 0.035mm
Design rules "default *": minimum track width 10mil, minimum drill 24mil, track to track 8mil, track to pad 8mil, pad to pad 8mil, via to via 8mil, smd to smd 8mil, copper to edge 0mil, drill to drill 8mil, minimum pad ring 10mil, minimum via ring 8mil, stop-mask expansion 4mil, vias tented up to drill 0mil, thermal gap 10mil
Holes 2 mm at 5,71.19 5,5 104.52,5 104.52,71.19
tRestrict: area 19.1,37.9 to 20.9,46.8; area 27,37.9 to 28.7,46.8; area 48.7,10.4 to 49.3,11.4; area 57.3,31.6 to 58.5,32.4; area 48.3,71.8 to 58.4,76.2; area 49,66.7 to 60.2,67.3; area 53.7,68.6 to 55.5,70.5; area 1.9,68.1 to 8,74.2; area 1.9,2 to 8,8; area 101.5,2 to 107.6,8; area 101.5,68.1 to 107.6,74.2; area 88.9,53.9 to 94.7,54.9; 3 more areas
bRestrict: area 1.9,68.1 to 8,74.2; area 1.9,2 to 8,8; area 101.5,2 to 107.6,8; area 101.5,68.1 to 107.6,74.2

### Footprints (pad centres in the part's own frame; a part is rotated, then mirrored left to right if it is on the bottom)
C0603 = smd 1.1 x 1: 1 -0.85,0; 2 0.85,0
C0402 = smd 0.7 x 0.9: 1 -0.65,0; 2 0.65,0
SMC_A = smd 1.6 x 1.4: + -1.5,0; - 1.5,0
SMC_B = smd 1.6 x 2.4: + -1.5,0; - 1.5,0
C0805 = smd 1.3 x 1.5: 1 -0.95,0; 2 0.95,0
SMC_C = smd 2.4 x 2.4: + -2.5,0; - 2.5,0
C1206 = smd 1.6 x 1.8: 1 -1.4,0; 2 1.4,0
1206L = smd 1 x 1.8: 1 -1.4,0; 2 1.4,0
SOT-23-6L = smd 0.6 x 1.2: 1 -0.95,-2.3; 2 0,-2.3; 3 0.95,-2.3; 4 0.95,0; 5 0,0; 6 -0.95,0
SOT223 = smd 1.219 x 2.235: 1 -2.311,-3.099; 2 0,-3.099; 3 2.311,-3.099 | smd 3.6 x 2.2: TAB 0,3.099
TSSOP28W = smd 0.45 x 1.75: P$1 0,-0.65; P$2 0.65,-0.65; P$3 1.3,-0.65; P$4 1.95,-0.65; P$5 2.6,-0.65; P$6 3.25,-0.65; P$7 3.9,-0.65; P$8 4.55,-0.65; P$9 5.2,-0.65; P$10 5.85,-0.65; P$11 6.5,-0.65; P$12 7.15,-0.65; P$13 7.8,-0.65; P$14 8.45,-0.65; P$15 8.45,7.2; P$16 7.8,7.2; P$17 7.15,7.2; P$18 6.5,7.2; P$19 5.85,7.2; P$20 5.2,7.2; P$21 4.55,7.2; P$22 3.9,7.2; P$23 3.25,7.2; P$24 2.6,7.2; P$25 1.95,7.2; P$26 1.3,7.2; P$27 0.65,7.2; P$28 0,7.2
TO92- = drill 0.813 octagon: 1 -2.54,0; 2 0,0; 3 2.54,0
1X06 = drill 1.016 long: 1 -6.35,0; 2 -3.81,0; 3 -1.27,0; 4 1.27,0; 5 3.81,0; 6 6.35,0
1X04 = drill 1.016 long: 1 -3.81,0; 2 -1.27,0; 3 1.27,0; 4 3.81,0
AUDIO-JACK2 = drill 1.3 pad 2.184: RING 5,5; SLEEVE 0,0; TIP 5,-5 | hole 1.2: 0,5; -2.5,5; -2.5,-5; 0,-5; 5,0
USB-B-MICRO-SMD_V03 = smd 1.4 x 0.4: D+1 2.7,0; D-1 2.7,0.65; GND1 2.7,-1.3; ID1 2.7,-0.65; VBUS1 2.7,1.3 | hole 0.5: 2.2,1.9; 2.2,-1.9
FB805 = smd 1.3 x 1.5: 1 -0.85,0; 2 0.85,0
CHIP-LED0603 = smd 0.8 x 0.8: A 0,-0.75; C 0,0.75
R0603 = smd 1 x 1.1: 1 -0.85,0; 2 0.85,0
R0805 = smd 1.3 x 1.5: 1 -0.95,0; 2 0.95,0
R1206 = smd 1.6 x 1.803: 1 -1.422,0; 2 1.422,0
R0402 = smd 0.7 x 0.9: 1 -0.65,0; 2 0.65,0
0204/7 = drill 0.813 octagon: 1 -3.81,0; 2 3.81,0
HR911105A = drill 0.813 pad 1.524: G+ 4.953,-6.604; G- 4.953,-4.064; GND -8.89,4.445; NC -6.35,3.175; P4 -8.89,-0.635; P5 -6.35,0.635; RD+ -6.35,-1.905; RD- -8.89,1.905; TD- -8.89,-3.175; Y+ 4.953,6.604; Y- 4.953,4.064 | drill 1.651 pad 2.159: SHIELD0 -2.921,8.001; SHIELD1 -2.921,-8.001 | drill 0.813 pad 1.524 square: TD+ -6.35,-4.445 | hole 3.556: 0,-5.715; 0,5.715
ML26L = drill 0.914 pad 1.676 octagon: 1 -15.24,-1.27; 2 -15.24,1.27; 3 -12.7,-1.27; 4 -12.7,1.27; 5 -10.16,-1.27; 6 -10.16,1.27; 7 -7.62,-1.27; 8 -7.62,1.27; 9 -5.08,-1.27; 10 -5.08,1.27; 11 -2.54,-1.27; 12 -2.54,1.27; 13 0,-1.27; 14 0,1.27; 15 2.54,-1.27; 16 2.54,1.27; 17 5.08,-1.27; 18 5.08,1.27; 19 7.62,-1.27; 20 7.62,1.27; 21 10.16,-1.27; 22 10.16,1.27; 23 12.7,-1.27; 24 12.7,1.27; 25 15.24,-1.27; 26 15.24,1.27
ML10L = drill 0.914 octagon: 1 -5.08,-1.27; 2 -5.08,1.27; 3 -2.54,-1.27; 4 -2.54,1.27; 5 0,-1.27; 6 0,1.27; 7 2.54,-1.27; 8 2.54,1.27; 9 5.08,-1.27; 10 5.08,1.27
USD-SOCKET-PP = smd 0.75 x 1.5: 1 3.2,14.3; 2 2.1,14.3; 3 1,14.3; 4 -0.1,14.3; 5 -1.2,14.3; 6 -2.3,14.3; 7 -3.4,14.3; 8 -4.5,14.3 | smd 1 x 1.3: CD1 -5.85,14.25 | smd 1.4 x 1: CD2 7.275,14.1 | smd 1.5 x 1.35: GND1 -6.775,4; GND2 7.875,4
LQFP48 = smd 0.25 x 1: 1 -2.75,-4.25; 2 -2.25,-4.25; 3 -1.75,-4.25; 4 -1.25,-4.25; 5 -0.75,-4.25; 6 -0.25,-4.25; 7 0.25,-4.25; 8 0.75,-4.25; 9 1.25,-4.25; 10 1.75,-4.25; 11 2.25,-4.25; 12 2.75,-4.25; 25 2.75,4.25; 26 2.25,4.25; 27 1.75,4.25; 28 1.25,4.25; 29 0.75,4.25; 30 0.25,4.25; 31 -0.25,4.25; 32 -0.75,4.25; 33 -1.25,4.25; 34 -1.75,4.25; 35 -2.25,4.25; 36 -2.75,4.25 | smd 1 x 0.25: 13 4.25,-2.75; 14 4.25,-2.25; 15 4.25,-1.75; 16 4.25,-1.25; 17 4.25,-0.75; 18 4.25,-0.25; 19 4.25,0.25; 20 4.25,0.75; 21 4.25,1.25; 22 4.25,1.75; 23 4.25,2.25; 24 4.25,2.75; 37 -4.25,2.75; 38 -4.25,2.25; 39 -4.25,1.75; 40 -4.25,1.25; 41 -4.25,0.75; 42 -4.25,0.25; 43 -4.25,-0.25; 44 -4.25,-0.75; 45 -4.25,-1.25; 46 -4.25,-1.75; 47 -4.25,-2.25; 48 -4.25,-2.75
TQFP100-12X12 = smd 0.95 x 0.25: 1 -6.725,4.8; 2 -6.725,4.4; 3 -6.725,4; 4 -6.725,3.6; 5 -6.725,3.2; 6 -6.725,2.8; 7 -6.725,2.4; 8 -6.725,2; 9 -6.725,1.6; 10 -6.725,1.2; 11 -6.725,0.8; 12 -6.725,0.4; 13 -6.725,0; 14 -6.725,-0.4; 15 -6.725,-0.8; 16 -6.725,-1.2; 17 -6.725,-1.6; 18 -6.725,-2; 19 -6.725,-2.4; 20 -6.725,-2.8; 21 -6.725,-3.2; 22 -6.725,-3.6; 23 -6.725,-4; 24 -6.725,-4.4; 25 -6.725,-4.8; 51 6.725,-4.8; 52 6.725,-4.4; 53 6.725,-4; 54 6.725,-3.6; 55 6.725,-3.2; 56 6.725,-2.8; 57 6.725,-2.4; 58 6.725,-2; 59 6.725,-1.6; 60 6.725,-1.2; 61 6.725,-0.8; 62 6.725,-0.4; 63 6.725,0; 64 6.725,0.4; 65 6.725,0.8; 66 6.725,1.2; 67 6.725,1.6; 68 6.725,2; 69 6.725,2.4; 70 6.725,2.8; 71 6.725,3.2; 72 6.725,3.6; 73 6.725,4; 74 6.725,4.4; 75 6.725,4.8 | smd 0.25 x 0.95: 26 -4.8,-6.725; 27 -4.4,-6.725; 28 -4,-6.725; 29 -3.6,-6.725; 30 -3.2,-6.725; 31 -2.8,-6.725; 32 -2.4,-6.725; 33 -2,-6.725; 34 -1.6,-6.725; 35 -1.2,-6.725; 36 -0.8,-6.725; 37 -0.4,-6.725; 38 0,-6.725; 39 0.4,-6.725; 40 0.8,-6.725; 41 1.2,-6.725; 42 1.6,-6.725; 43 2,-6.725; 44 2.4,-6.725; 45 2.8,-6.725; 46 3.2,-6.725; 47 3.6,-6.725; 48 4,-6.725; 49 4.4,-6.725; 50 4.8,-6.725; 76 4.8,6.725; 77 4.4,6.725; 78 4,6.725; 79 3.6,6.725; 80 3.2,6.725; 81 2.8,6.725; 82 2.4,6.725; 83 2,6.725; 84 1.6,6.725; 85 1.2,6.725; 86 0.8,6.725; 87 0.4,6.725; 88 0,6.725; 89 -0.4,6.725; 90 -0.8,6.725; 91 -1.2,6.725; 92 -1.6,6.725; 93 -2,6.725; 94 -2.4,6.725; 95 -2.8,6.725; 96 -3.2,6.725; 97 -3.6,6.725; 98 -4,6.725; 99 -4.4,6.725; 100 -4.8,6.725
SO-08M = smd 0.6 x 2.2: 1 -1.905,-3.33; 2 -0.635,-3.33; 3 0.635,-3.33; 4 1.905,-3.33; 5 1.905,3.33; 6 0.635,3.33; 7 -0.635,3.33; 8 -1.905,3.33
3.2X1.5-2-PAD = smd 1.1 x 1.9: 1 -1.25,0; 2 1.25,0
22-23-2021 = drill 1 long: 1 -1.27,0; 2 1.27,0
KUSBVX = drill 0.9 pad 1.524: 1 3.5,0; 2 1,0; 3 -1,0; 4 -3.5,0 | drill 2.3 pad 2.8: M1 -6.57,2.71; M2 6.57,2.71
CRYSTAL-SMD-5X3.2-4PAD = smd 1.9 x 1.1: 1 -1.85,-1.15; 2 1.85,-1.15; 3 1.85,1.15; 4 -1.85,1.15

### Placement (x,y rotation side)
C1  54.27,17.17 270 top
C2  51.33,17.17 270 top
C3  62.53,36.03 270 top
C4  46.66,28.37 180 top
C5  39.87,56.36 180 top
C6  59.69,8.09 90 top
C7  60.27,69.65 90 top
C8  50.19,69 90 top
C9  50.19,64.99 270 top
C10  53.21,64.34 270 top
C11  15.97,24.38 180 top
C12  98.01,57.44 0 top
C13  92.43,57.44 0 top
C14  26.97,50.8 0 top
C15  14.88,50.7 0 top
C16  17.34,38.1 180 top
C17  17.12,46.55 180 top
C18  17.11,43.96 180 top
C19  88.82,57.44 180 top
C20  65.55,27.61 180 top
C21  9.17,41.98 180 top
C22  9.17,40.06 180 top
C23  65.59,30.11 180 top
C24  32.16,37.63 0 top
C25  64.06,36.83 270 top
C26  59.14,46.33 0 top
C27  42.44,6.17 180 top
C28  54.39,55.85 180 top
C29  19.68,27.94 270 bottom
C30  92.43,64.27 270 top
C31  17.14,27.37 180 top
C32  17.34,39.6 180 top
C33  98.01,60.53 180 top
C34  38.68,38.28 90 top
C35  41.91,42.34 270 top
C36  85.57,60.48 0 top
C37  42.97,35.86 90 top
C38  52.67,53.82 0 top
C39  51.32,26.92 180 top
C40  83.28,51.29 90 top
C41  89.63,43.74 0 top
C42  92.94,43.74 0 top
C43  88.82,63.63 0 top
C44  96.82,63.61 180 top
C45  84.5,51.79 90 top
C46  81.84,48.64 270 top
C47  103.76,49.58 270 top
C48  96.64,44.75 0 top
C49  90.43,35.31 270 top
C50  92.2,35.31 270 top
C51  77.85,69.9 180 top
C52  67.31,60.68 90 top
C53  71.14,59.56 90 top
C54  78.96,65.89 180 top
C55  94.36,27.05 270 top
C56  84.58,41.96 270 top
C57  101.72,49.58 270 top
C58  100.71,56.62 90 top
F1  54.64,69.55 270 top
IC1  49.04,12.04 0 top
IC2  44.5,65.84 90 top
IC3  77.26,60.48 270 top
IC4  27.23,38.1 90 top
IC5  99.06,28.37 0 bottom
JP1  51.99,58.27 0 bottom
JP2  30.07,25.12 270 bottom
JP3  93.34,72.29 270 top
JP5  53.34,75.56 270 top
L1  91.82,52.32 0 bottom
L2  85.9,55.35 180 top
L3  17.44,49.85 90 top
LED1  42.13,48.26 270 top
LED2  42.13,50.16 270 top
LED3  42.13,52.07 270 top
LED4  42.13,53.98 270 top
R1  98.21,26.67 180 top
R2  30.17,50.8 0 top
R3  28.93,48.77 180 top
R4  21.65,48.77 180 top
R5  20.42,50.7 0 top
R6  25.27,48.77 0 top
R7  38.03,46.44 0 top
R8  17.99,22.5 270 bottom
R9  52.67,52.1 180 top
R10  41.4,45.59 90 top
R11  16.2,30.28 270 bottom
R12  24.1,20.73 180 top
R13  19.73,26.52 90 top
R14  45.08,48.26 180 top
R15  45.08,50.16 180 top
R16  45.08,52.07 180 top
R17  17.99,32.82 0 top
R18  45.08,53.98 180 top
R19  17.99,35.36 180 top
R20  45.08,45.49 270 top
R21  83.84,73.13 0 top
R22  88.82,60.48 0 top
R23  92.43,59.97 270 top
R24  96.34,58.95 180 top
R25  88.82,58.95 0 top
R26  98.77,52.29 90 top
R27  97.51,52.79 90 top
R28  84.63,48.04 270 top
R29  85.85,47.54 270 top
R30  101.49,47.91 180 bottom
R31  88.82,62.05 0 top
R32  96.82,62.05 180 top
R33  95.14,65.13 180 top
R34  88.81,65.15 180 top
R35  91.32,37.72 0 top
R36  69.08,51.63 90 top
RJ1  26.56,67.13 90 bottom
SV1  80.01,10.79 180 bottom
SV3  28.16,10.82 180 bottom
U1  0,29.21 90 bottom
U2  91.82,50.16 270 top
U$1  52.6,38.51 270 top
U$2  23.47,26.21 0 top
X1  62.3,28.85 90 top
X2  16.72,16.51 180 bottom
X3  49.04,8.26 0 bottom
X4  100.33,16.51 0 bottom
X5  83.36,23.83 0 bottom
Y1  52.8,22 0 top
Y2  13.36,41.02 270 top
Y3  91.32,41.02 180 top

### Tracks (layer width: path | path; a pad name or v marks a point on that pad's centre or on a via)
1WIRE
  Top 0.254: U$1.5 55.8,47.19 56.94,48.34 61.59,48.34 64.94,44.98 70.96,44.98 78.56,37.39 78.56,32.61 80.59,30.58 96.85,30.58 IC5.2
  Top 0.61: R1.1 IC5.2
_2V6  (via drill 0.6 pad 1.42)
  Top 0.406: C54.1 80.37,66.04 80.36,66.04
  Top 0.61: IC3.TAB 80.36,57.81 v82.83,55.35 L2.2
  Top 1.016: IC3.2 IC3.TAB 80.36,66.04 80.36,69.89 C51.+
  Bottom 0.61: L1.2 89.66,52.32 86.64,55.35 v82.83,55.35
_3V  (via drill 0.6 pad 1.42)
  Top 0.251: U2.6 83.5,50.41 C40.1 | C42.1 92.07,43.96 U2.19 92.07,46.86 89.57,46.86 U2.14 89.57,45.05 88.98,44.46 C41.1 | R30.2 105.3,50.8 104.7,51.41 100.78,51.41 100.29,50.91 U2.32
  Top 0.254: C26.1 57.22,46.33 57,46.11 U$1.2 57,43.87 51.4,43.87 | R9.2 51.43,52.09 51.4,52.07 | C38.1 51.4,53.4 51.4,52.07 | C25.1 63.83,37.71 U$1.86 58.42,37.71 58.42,32.69 52.2,32.69 | 51.4,52.07 U$1.16 51.4,43.87 | C34.1 39.48,37.63 40.76,38.91 U$1.37 46.71,38.91 46.78,38.84 | C39.1 52.2,27.15 U$1.62 52.2,32.69 | 49.37,32.69 46.78,32.69 46.78,35.31 | 49.37,32.69 52.2,32.69 | 46.78,35.31 46.78,38.84 | 46.78,35.31 U$1.46 43.09,35.31 C37.1 | 49.37,32.69 49.4,32.66 U$1.55 49.4,29.69 48.08,28.37 C4.1 | LED4.A 41.4,53.98 | LED3.A 41.4,52.07 | LED2.A 41.4,50.16 | LED1.A 41.4,48.26 | 51.4,43.87 47.65,43.87 | 47.65,43.87 46.73,44.78 46.73,45.97 46.27,46.44 R20.1 | 47.65,43.87 47.65,39.7 46.78,38.84
  Top 0.305: C41.1 88.36,43.74 87.44,42.81 84.82,42.81 | U$2.3 24.1,19.39 | C56.1 84.82,42.81 | 84.82,42.81 84.83,42.82
  Top 0.406: C5.+ 41.37,56.49 41.4,56.52 | C11.+ 17.74,24.38 17.99,24.13 | C40.1 v77.67,50.64 | R1.2 96.77,26.67 96.52,26.92
  Top 0.457: C32.1 17.99,39.69 18.35,40.05 IC4.P$25 21.48,40.05 21.48,43.3 | IC4.P$28 C16.1 | L3.1 17.91,48.52 17.96,48.52 C17.1 | IC4.P$15 C17.1 | C17.1 C18.1 IC4.P$19 21.48,43.95 21.48,43.3 | IC4.P$20 21.48,43.3
  Top 0.508: C32.1 C16.1 v17.99,29.11 | R13.2 C31.1
  Top 0.61: 38.86,46.47 R7.2 R10.2 | 41.4,56.52 41.4,53.98 41.4,52.07 41.4,50.16 41.4,48.26 R10.2 | C10.+ 53.33,65.84 53.34,65.84 | R10.2 R20.1 arc-45 R20.1 | R13.2 21.56,27.37 U$2.8 U$2.7 | 17.99,19.3 17.99,24.13 C31.1 v17.99,29.11 | JP2.4 28.15,19.39 24.1,19.39 18.08,19.39 17.99,19.3 | 17.99,19.3 X2.2 | C55.1 94.36,28.25 94.48,28.37 | R36.2 69.08,55.24 | v81.07,42.82 84.56,42.82 C56.1
  Top 0.813: IC2.TAB IC2.2 C9.1 53.34,65.84 60.65,65.84 62.1,64.39 62.1,57.66 64.51,55.24 69.08,55.24 70.37,55.24 74.98,50.64 v77.67,50.64 | IC2.TAB 41.4,65.15 | IC2.TAB 41.4,56.52 | X2.2 17.99,8.68 22.22,4.45 95.56,4.45 99.06,7.94 X4.2 99.06,22.48 96.52,25.02 96.52,26.92 IC5.3 94.48,28.37 v82.78,28.37
  Bottom 0.406: R11.2 16.19,29.43 15.87,29.11
  Bottom 0.457: v17.99,29.11 19.36,29.11 C29.1
  Bottom 0.61: U1.4 15.87,29.11 v17.99,29.11 | R8.2 X2.2
  Bottom 0.813: v82.78,28.37 82.78,41.12 v81.07,42.82 77.67,46.23 v77.67,50.64 | IC5.3 96.52,33.53 105.3,42.32 R30.2
AVDD_3V
  Top 0.254: C35.1 42.78,42.99 44.07,41.71 U$1.30 46.81,41.71 46.81,43.87 46.13,44.54 R20.2
CE1
  Top 0.406: R12.2 22.09,20.73 21.56,21.26 U$2.1
  Top 0.61: R13.1 21.56,25.67 U$2.1
D2_N
  Top 0.406: 48.09,8.3 X3.2
  Top 0.599: IC1.1 48.09,8.3
D2_P
  Top 0.406: 49.99,8.3 X3.3
  Top 0.599: IC1.3 49.99,8.3
D_N
  Top 0.25: 48.09,13.12 48.82,13.84
  Top 0.254: U$1.56 49.8,28.61 47.19,26 47.19,16.62 48.82,14.99 48.82,13.84 | IC1.6 48.09,13.12
D_P
  Top 0.25: 49.99,13.12 49.27,13.84
  Top 0.254: U$1.57 50.2,28.37 47.65,25.81 47.65,16.81 49.27,15.18 49.27,13.84 | IC1.4 49.99,13.12
ENC_CS
  Top 0.254: IC4.P$9 37.4,43.3 38.45,44.35 41.27,44.35 | U$1.26 44.04,43.31 43,44.35 41.27,44.35 | R10.1 41.4,44.48 41.27,44.35
ENC_RST
  Top 0.406: IC4.P$10 36.15,43.95 37.18,44.98 R7.1
FLASH_CS
  Top 0.254: R12.1 26.44,20.73 27.94,22.23 27.94,29.57 29.61,31.24 29.61,33.68 30.27,34.34 34.67,34.34 36.9,36.58 39.21,36.58 41.14,38.51 U$1.38
GND  (via drill 0.5 pad 1.27, 0.6 pad 1.02, 0.6 pad 1.27, 0.61 pad 1.42)
  Top 0.251: U2.4 86.05,51.41 85,52.44 C45.2 | U2.20 92.57,46.86 93.04,46.86 | 93.04,46.86 93.57,46.86 U2.22 93.57,43.76 C42.2 | U2.21 93.07,46.83 93.04,46.86 | U2.16 90.57,44.98 90.28,44.69 C41.2
  Top 0.254: C34.2 39.86,38.93 40.24,39.31 U$1.36 | U$1.31 43.6,41.31 43.22,41.69 C35.2 | U$1.45 44.43,35.71 43.62,36.52 C37.2 | U$1.15 51.8,50.33 52.68,51.21 52.68,52.93 53.53,53.79 C38.2 | U$1.65 53.4,26.91 54.32,26 v54.32,24.84 | U$1.75 57.4,31.32 57.69,31.03 v59.39,31.03 | IC1.2 49.22,9.74 49.22,10.48 49.64,10.9 50.41,10.9 50.52,10.79
  Top 0.406: JP5.GND1 v52.04,70.17
  Top 0.457: IC4.P$11 25.73,44.6 | IC4.P$18 23.06,44.6 | IC4.P$21 18.36,42.65 | IC4.P$22 18.25,42 17.7,42.55 | IC4.P$2 29.31,38.75 v30.34,39.78
  other vias: 20.62,53.01 14.22,45.19 24.28,50.65 26.82,54.08 26.61,22.96 56.55,63.9 61.4,44.83 65.92,25.04 37.22,37.87 40.32,42.34 41.36,34.47 48.98,22.81 40.61,72.71 60.27,73.34 65.39,36.22 45.81,26.62 10,38.33 16.76,54.08 9.37,16.74 105.13,36.68 81.71,46.35 71.85,66.01 91.28,21.21 37.94,52.93 8.1,61.19 41.36,23.44 81.65,52.05 87.19,46.15 95.45,39.8 87.83,35.99 100.78,53.98 103.09,45.31
  pour Top (isolate 0.305, rank 2, no thermals): 0,76.19 0,0 109.52,0 109.52,76.19
  pour Bottom (isolate 0.305, no thermals): 0,76.19 0,0 109.52,0 109.52,76.19
LEDA
  Top 0.406: IC4.P$27 21.51,38.75 21.51,36.04 20.82,35.36 R19.1
LEDB
  Top 0.406: IC4.P$26 22.4,39.4 22.4,34.54 20.67,32.82 R17.2
MCLR
  Top 0.254: U$1.13 52.6,50.32 53.52,51.24 R9.1 | 55.24,54.61 C28.1
  Top 0.305: R9.1 53.92,52.49 54.2,52.49 55.24,53.53 55.24,54.61
  Top 0.406: C28.1 57.12,55.85 58.34,57.07 JP1.1
MISO  (via drill 0.6 pad 1.42)
  Top 0.254: IC4.P$6 36.09,41.35 36.93,40.51 U$1.33
  Top 0.305: U$2.2 22.83,25.63 23.8,26.59 25.85,26.59 26.64,27.38 v26.64,32.38 26.64,33.93 26.23,34.34 26.23,41.02 26.56,41.35 26.57,41.35 IC4.P$6
  Bottom 0.305: U1.7 21.56,25.81 26.64,30.89 v26.64,32.38 26.64,31.11
MOSI  (via drill 0.6 pad 1.42)
  Top 0.254: IC4.P$7 36.23,42 37.32,40.91 U$1.32
  Top 0.305: IC4.P$7 26.2,42 25.37,41.17 v25.37,33.55 U$2.5
  Bottom 0.305: v25.37,33.55 23.62,33.55 20.34,30.28 14.36,30.28 U1.3
N$1
  Top 0.254: U$1.85 62.11,37.31 C3.1
N$2
  Top 0.61: R3.2 28.08,50.62 28,50.62 C14.2 R2.1
N$3
  Top 0.61: LED1.C R14.2
N$5
  Top 0.61: LED2.C R15.2
N$6
  Top 0.254: RJ1.P4 25.93,61.39 24.58,62.74 20.85,62.74 20.16,62.05 20.16,54.13 19.57,53.53 R5.1
  Top 0.61: R4.2 19.57,48.77 R5.1 L3.2 | L3.2 | C15.2 L3.2
N$8
  Top 0.61: LED3.C R16.2
N$10
  Top 0.61: LED4.C R18.2
N$12
  Top 0.406: IC4.P$14 26.78,46.55 26.22,47.11 R6.2
N$13  (via drill 0.6 pad 1.27)
  other vias: 5,5
N$14  (via drill 0.6 pad 1.27)
  other vias: 104.52,5
N$15  (via drill 0.6 pad 1.27)
  other vias: 104.52,71.19
N$17
  Top 0.406: JP5.VBUS1 F1.1
N$18
  Top 0.406: C30.2 R23.1
N$22
  Top 0.305: IC4.P$23 12.21,41.35 | 12.21,41.35 11.43,41.35 10.79,41.98 C21.1 | Y2.1 12.21,41.36 12.21,41.35
N$23
  Top 0.305: IC4.P$24 14.53,40.7 | 14.53,40.7 11.44,40.7 10.8,40.06 C22.1 | Y2.3 14.51,40.68 14.53,40.7
N$29
  Top 0.457: IC4.P$1 30.19,38.1 C24.+
N$30
  Top 0.406: RJ1.Y+ 31.8,73.46 18.13,73.46 14.78,70.1 14.78,58.55 5.46,49.23 5.46,37.77 8.68,34.54 13.46,34.54 15.19,32.82 R17.1
N$31
  Top 0.406: R19.2 9.01,35.36 6.27,38.1 6.27,48.9 15.59,58.22 15.59,69.77 17.9,72.08 RJ1.G+
N$36  (via drill 0.6 pad 1.27)
  other vias: 5,71.19
OSC1
  Top 0.254: U$1.63 52.6,20.88 | 52.6,20.88 52.6,20.24 51.33,18.97 C2.1 | Y1.1 52.57,20.85 52.6,20.88
OSC2
  Top 0.254: U$1.64 53,23.06 | 53,23.06 53,20.24 54.27,18.97 C1.1 | Y1.3 53.08,23.15 53,23.06
PGEC
  Top 0.254: JP1.5 48.2,58.25 48.2,56.45 49.15,55.5 49.58,55.07 49.8,54.84 U$1.20
PGED
  Top 0.254: JP1.4 50.72,59.89 50.16,60.45 47.62,60.45 46.91,59.74 46.91,56.92 49.4,54.43 U$1.21
RA6
  Top 0.254: U$1.91 66.79,39.71 71.85,34.65 71.85,20.09 77.49,14.45 78.46,14.45 79.57,13.34 80.57,13.34 81.28,12.62 81.28,10.79 SV1.16
RA7
  Top 0.254: U$1.92 67.18,40.11 72.41,34.87 72.41,20.32 77.72,15.01 78.69,15.01 79.8,13.89 80.79,13.89 82.55,12.14 SV1.15
RA14
  Top 0.254: U$1.66 53.8,27.38 59.05,22.12 59.05,15.24 SV1.2
RA15
  Top 0.254: U$1.67 54.2,27.76 59.61,22.35 59.61,15.47 63.01,12.06 SV1.1
RB0
  Top 0.254: U$1.25 47.8,47.45 46.99,48.26 R14.1
RB1
  Top 0.254: U$1.24 48.2,48.95 46.99,50.16 R15.1
RB2
  Top 0.254: U$1.23 48.6,50.46 46.99,52.07 R16.1
RB3
  Top 0.254: U$1.22 49,51.96 46.99,53.98 R18.1
RB12
  Top 0.254: U$1.41 42.31,37.31 39.9,34.9 38.86,34.9 34.77,30.81 34.77,19.91 32.13,17.27 31.11,17.27 29.99,16.15 29.03,16.15 27.91,15.04 26.95,15.04 25.83,13.92 24.86,13.92 23.09,12.14 SV3.1
RD0
  Top 0.254: U$1.72 56.2,29.7 62.4,23.5 62.4,16.61 63.45,15.57 66.21,15.57 67.33,14.45 68.3,14.45 69.41,13.34 70.38,13.34 71.12,12.6 71.12,10.79 SV1.8
RD1
  Top 0.254: U$1.76 59.79,33.71 61.11,32.38 66.67,32.38 67.94,31.11 67.94,18.49 72.39,14.05 SV1.7
RD2
  Top 0.254: U$1.77 60.17,34.11 61.34,32.94 66.9,32.94 68.5,31.34 68.5,18.72 73.66,13.56 73.66,10.79 SV1.10
RD3
  Top 0.254: U$1.78 60.56,34.51 61.57,33.5 67.13,33.5 69.06,31.57 69.06,18.95 74.93,13.08 SV1.9
RD8
  Top 0.254: U$1.68 54.6,28.15 60.17,22.58 60.17,15.7 62.53,13.34 65.3,13.34 66.04,12.6 66.04,10.79 SV1.4
RD9
  Top 0.254: U$1.69 55,28.54 60.73,22.81 60.73,15.93 62.76,13.89 65.53,13.89 67.31,12.12 SV1.3
RD10
  Top 0.254: SV1.6 68.58,10.79 68.58,12.6 67.84,13.34 66.87,13.34 65.76,14.45 62.99,14.45 61.29,16.15 61.29,23.04 55.4,28.93 U$1.70
RD11
  Top 0.254: U$1.71 55.8,29.31 61.85,23.27 61.85,16.38 63.22,15.01 65.99,15.01 67.1,13.89 68.07,13.89 69.85,12.12 SV1.5
RD12
  Top 0.254: U$1.79 60.95,34.91 61.79,34.06 67.36,34.06 69.62,31.8 69.62,19.18 76.2,12.6 76.2,10.79 SV1.12
RD14
  Top 0.254: U$1.47 44.07,34.91 42.34,33.17 39.19,33.17 35.33,29.31 35.33,19.68 32.36,16.71 31.34,16.71 30.22,15.6 29.26,15.6 28.14,14.48 27.17,14.48 26.06,13.36 25.09,13.36 24.36,12.62 24.36,10.82 SV3.2
RD15
  Top 0.254: U$1.48 44.46,34.51 42.57,32.61 39.42,32.61 35.89,29.08 35.89,19.46 32.58,16.15 31.57,16.15 30.45,15.04 29.49,15.04 28.37,13.92 27.4,13.92 25.63,12.14 SV3.3
RE0
  Top 0.254: U$1.93 67.57,40.51 72.97,35.1 72.97,20.55 77.95,15.57 78.91,15.57 80.03,14.45 81.02,14.45 82.14,13.34 83.11,13.34 83.82,12.62 83.82,10.79 SV1.18
RE1
  Top 0.254: U$1.94 67.95,40.91 73.53,35.33 73.53,20.78 77.06,17.25 77.31,16.99 78.18,16.13 79.14,16.13 80.26,15.01 81.25,15.01 82.37,13.89 83.33,13.89 85.09,12.14 SV1.17
RE2
  Top 0.254: U$1.98 69.5,42.51 75.76,36.25 75.76,21.69 79.09,18.36 80.06,18.36 81.17,17.25 82.17,17.25 83.28,16.13 84.25,16.13 85.37,15.01 86.33,15.01 87.45,13.89 88.41,13.89 90.17,12.14 SV1.21
RE3
  Top 0.254: U$1.99 69.89,42.91 76.32,36.47 76.32,21.92 79.32,18.92 80.29,18.92 81.4,17.8 82.39,17.8 83.51,16.69 84.48,16.69 85.59,15.57 86.56,15.57 87.68,14.45 88.64,14.45 89.76,13.34 90.73,13.34 91.44,12.62 91.44,10.79 SV1.24
RE4
  Top 0.254: U$1.100 70.28,43.31 76.88,36.7 76.88,22.15 79.55,19.48 80.51,19.48 81.63,18.36 82.62,18.36 83.74,17.25 84.71,17.25 85.82,16.13 86.79,16.13 87.91,15.01 88.87,15.01 89.99,13.89 90.95,13.89 92.71,12.14 SV1.23
RE5
  Top 0.254: U$1.3 56.6,46.49 57.32,47.22 61.13,47.22 64.49,43.87 70.51,43.87 77.44,36.93 77.44,22.38 79.78,20.04 80.74,20.04 81.86,18.92 82.85,18.92 83.97,17.8 84.93,17.8 86.05,16.69 87.02,16.69 88.13,15.57 89.1,15.57 90.22,14.45 91.18,14.45 92.3,13.34 93.27,13.34 93.98,12.62 93.98,10.79 SV1.26
RE6
  Top 0.254: U$1.4 56.2,46.88 57.1,47.78 61.36,47.78 64.72,44.42 70.74,44.42 78,37.16 78,22.61 80.01,20.6 80.97,20.6 82.09,19.48 83.08,19.48 84.2,18.36 85.16,18.36 86.28,17.25 87.25,17.25 88.36,16.13 89.33,16.13 90.45,15.01 91.41,15.01 92.53,13.89 93.49,13.89 95.25,12.14 SV1.25
RF0
  Top 0.254: U$1.87 66.03,38.11 70.18,33.96 70.18,19.41 77.47,12.12 SV1.11
RF1
  Top 0.254: U$1.88 66.42,38.51 70.74,34.19 70.74,19.63 77.03,13.34 78,13.34 78.74,12.6 78.74,10.79 SV1.14
RF2
  Top 0.254: U$1.52 48.2,30.86 47.72,30.38 40.33,30.38 38.12,28.17 38.12,18.54 33.5,13.92 32.48,13.92 30.71,12.14 SV3.7
RF3
  Top 0.254: SV3.6 29.44,10.82 29.44,12.62 30.17,13.36 31.14,13.36 32.25,14.48 33.27,14.48 37.56,18.77 37.56,28.4 40.1,30.94 47.49,30.94 47.8,31.24 U$1.51
RF4
  Top 0.254: U$1.49 44.85,34.11 42.8,32.05 39.65,32.05 36.45,28.85 36.45,19.23 32.81,15.6 31.8,15.6 30.68,14.48 29.71,14.48 28.6,13.36 27.63,13.36 26.9,12.62 26.9,10.82 SV3.4
RF5
  Top 0.254: U$1.50 45.23,33.71 43.02,31.5 39.87,31.5 37,28.63 37,19 33.04,15.04 32.03,15.04 30.91,13.92 29.94,13.92 28.17,12.14 SV3.5
RF8
  Top 0.254: U$1.53 48.6,30.47 47.95,29.82 40.56,29.82 38.68,27.94 38.68,18.31 33.73,13.36 32.71,13.36 31.98,12.62 31.98,10.82 SV3.8
RG1
  Top 0.254: U$1.89 66.8,38.91 71.29,34.42 71.29,19.86 77.26,13.89 78.23,13.89 80.01,12.12 SV1.13
RG12
  Top 0.254: U$1.96 68.73,41.71 74.65,35.79 74.65,21.23 78.63,17.25 79.6,17.25 80.72,16.13 81.71,16.13 82.83,15.01 83.79,15.01 84.91,13.89 85.87,13.89 87.63,12.14 SV1.19
RG13
  Top 0.254: U$1.97 69.12,42.11 75.21,36.02 75.21,21.46 77.75,18.92 77.86,18.81 78.86,17.8 79.83,17.8 80.95,16.69 81.94,16.69 83.05,15.57 84.02,15.57 85.14,14.45 86.1,14.45 87.22,13.34 88.19,13.34 88.9,12.62 88.9,10.79 SV1.22
RG14
  Top 0.254: U$1.95 68.34,41.31 74.09,35.56 74.09,21.01 78.41,16.69 79.37,16.69 80.49,15.57 81.48,15.57 82.6,14.45 83.56,14.45 84.68,13.34 85.65,13.34 86.36,12.62 86.36,10.79 SV1.20
RXD
  Top 0.254: U$1.40 41.92,37.71 39.67,35.46 37.36,35.46 32.94,31.04 32.94,25.32 31.47,23.85 JP2.3
SCK  (via drill 0.6 pad 1.42)
  Top 0.254: IC4.P$8 37.54,42.65 38.68,43.79 42.77,43.79 43.65,42.91 U$1.27
  Top 0.305: IC4.P$8 25.83,42.65 24.1,40.92 v24.1,32.38 U$2.6
  Bottom 0.305: U1.5 14.37,27.94 21.56,27.94 24.1,30.48 v24.1,32.38
SD_CS  (via drill 0.6 pad 1.42)
  Top 0.254: U$1.34 36.29,40.11 34.92,38.73 34.92,36.2 34.18,35.46 29.82,35.46 v27.91,33.55
  Bottom 0.305: U1.2 15.87,31.31 20.51,31.31 23.92,34.72 26.74,34.72 v27.91,33.55
  Bottom 0.406: R11.1 16.05,31.13 15.87,31.31
SD_PRESENT  (via drill 0.6 pad 1.42)
  Top 0.254: U$1.35 36.68,39.71 35.48,38.51 35.48,35.97 34.41,34.9 30.04,34.9 29.05,33.91 29.05,32.31 v27.91,31.17
  Bottom 0.305: R8.1 20.1,23.35 v27.91,31.17
  Bottom 0.61: U1.CD1 16.04,23.36 R8.1
SOSCI
  Top 0.254: X1.1 60.94,27.6 59.97,28.57 58.52,28.57 56.6,30.49 U$1.73
  Top 0.406: X1.1 62.41,27.61 C20.2
SOSCO
  Top 0.254: X1.2 60.93,30.1 59.97,29.13 58.75,29.13 57,30.88 U$1.74
  Top 0.406: X1.2 62.41,30.11 C23.2
TPIN_N
  Top 0.254: IC4.P$12 29.62,45.25 30.63,46.26 30.63,50.83 | RJ1.RD- 30.63,56.08 30.63,55.7 arc90 31.01,55.32 31.92,55.32 arc-90 32.3,54.94 32.3,54.9 arc-90 31.92,54.51 31.01,54.51 arc90 30.63,54.13 30.63,54.09 arc90 31.01,53.71 31.92,53.71 arc-90 32.3,53.33 32.3,53.28 arc-90 31.92,52.9 31.01,52.9 arc90 30.63,52.52 30.63,50.83 | R2.2 30.65,50.8 30.63,50.83
TPIN_P
  Top 0.254: IC4.P$13 29.62,45.9 30.17,46.45 30.17,49.07 | 30.17,49.07 30.17,55.91 29.13,56.95 25.4,56.95 24.66,57.68 RJ1.RD+ | R3.1 29.87,48.77 30.17,49.07
TPOUT_N
  Top 0.254: R5.2 21.66,50.7 | 21.66,50.7 21.66,58.9 20.82,59.74 20.82,61.77 21.13,62.08 23.11,62.08 23.39,61.8 RJ1.TD- | 21.66,50.7 21.66,46.27 21.29,45.9 IC4.P$16
TPOUT_P
  Top 0.254: 22.12,48.67 22.12,46.08 21.29,45.25 IC4.P$17 | R4.1 22.12,48.67 | 22.12,48.67 22.12,52.55 arc-90 22.5,52.93 23.79,52.93 arc90 24.17,53.31 24.17,53.32 arc90 23.79,53.7 22.5,53.7 arc-90 22.12,54.08 22.12,54.09 arc-90 22.5,54.47 23.79,54.47 arc90 24.17,54.85 24.17,54.86 arc90 23.79,55.24 22.5,55.24 arc-90 22.12,55.63 RJ1.TD+
TXD
  Top 0.254: U$1.39 41.53,38.11 39.44,36.02 37.13,36.02 32.38,31.27 32.38,27.3 31.47,26.39 JP2.2
VBUS  (via drill 0.6 pad 1.42)
  Top 0.254: IC1.5 48.87,12.04 48.87,11.26 48.49,10.88 45.56,10.88 45.54,10.9 | U$1.54 49,30.08 48.18,29.26 44.5,29.26 43.81,28.57 43.81,15.88 45.54,14.14 45.54,10.9 | X3.1 45.54,10.9
  Top 0.406: C6.+ 59.69,6.17 | C52.+ 67.07,58.18 67.05,58.17 | C53.1 71.12,58.16 71.12,58.17
  Top 0.813: C7.+ | 45.55,8.25 X3.1 45.54,6.34 45.72,6.17 | 45.72,6.17 59.69,6.17 95.07,6.17 97.15,8.26 97.15,21.97 95.3,23.82 X5.1 | 45.72,6.17 C27.1 | IC2.3 C8.1 | C8.1 | C8.1 F1.2 C7.+ | C7.+ 62.91,68.15 64.51,66.55 64.51,58.8 65.15,58.17 67.05,58.17 71.12,58.17 IC3.3 74.16,56.39 75.23,55.32 v79.32,55.32
  Bottom 0.813: X5.1 84.63,41.48 79.32,46.79 v79.32,55.32
VS_AGND
  Top 0.251: U2.47 89.57,55.06 87.97,56.65 C19.2 | U2.41 92.57,55.36 92.95,55.36 93.07,55.24 | U2.40 93.07,55.24 | 93.07,55.24 93.07,57.23 C13.2 | U2.37 94.57,55.07 95.75,56.26 98.55,56.26 98.87,56.58 C12.2
  Top 0.406: C19.2 R25.1 84.72,58.95 C36.1 | C33.1 C12.2 | 93.34,69.93 93.27,69.85 | 84.82,63.4 84.72,63.5 | C13.2 94.29,58.46 R33.2
  Top 0.61: 91.82,69.85 93.27,69.85 98.93,69.85 100.2,68.58 100.2,66.17 98.87,64.83 C33.1 | 91.82,69.85 86.1,69.85 84.72,68.47 84.72,65.15 | JP3.SLEEVE 93.34,69.93 | C36.1 84.72,63.5 84.72,65.15 | 91.82,69.85 91.82,66.67 92.43,66.06 C30.1 R33.2 | R34.2 84.72,65.15
  pour Top (isolate 0.305, no thermals): 84.2,76.2 84.2,57.02 102.1,57.02 102.1,68.07 100.71,69.47 100.71,76.2
VS_AVDD  (via drill 0.6 pad 1.42)
  Top 0.251: C19.1 89.67,56.66 90.57,55.76 U2.45 90.57,53.47 91.57,53.47 | C13.1 91.57,56.8 U2.43 91.57,53.47 | C12.1 95.82,57.44 94.07,55.69 U2.38 94.07,53.47 | 94.07,53.47 91.57,53.47 | 94.07,53.47 95.14,53.47 v96.01,54.33
  Top 0.406: v96.01,54.33 97.3,55.63 100.57,55.63 C58.1
  Bottom 0.61: L1.1 94,52.32 v96.01,54.33
VS_CVDD
  Top 0.251: C45.1 84.73,50.91 U2.5 88.59,50.91 | 88.59,50.91 88.59,53.39 | 94.56,49.91 94.57,49.91 U2.24 94.57,44.76 C48.1 | 94.56,49.91 95.06,50.41 U2.31 101.71,50.41 C57.1 | 88.59,50.91 88.59,49.91 | 88.59,49.91 94.56,49.91 | 88.59,49.91 U2.7 82.26,49.91 C46.1
  Top 0.254: 88.59,53.39 86.75,55.23 L2.1
  Top 0.61: C57.1 C47.1
VS_DREQ
  Top 0.254: U$1.8 54.6,48.35 56.26,50.01 62.28,50.01 65.63,46.66 71.65,46.66 73.22,45.09 82.32,45.09 82.93,45.7 82.93,48.9 83.45,49.41 U2.8
VS_MISO  (via drill 0.6 pad 1.42)
  Top 0.254: U$1.9 54.2,48.74 56.03,50.57 62.51,50.57 65.86,47.22 72.72,47.22 v73.68,46.25 | U2.30 98.85,49.91 101.19,47.57 101.19,33.71 98.62,31.14 80.82,31.14 79.12,32.84 79.12,38.46 v74.75,42.82
  Bottom 0.254: v74.75,42.82 74.75,43.74 74.27,44.22 74.27,45.67 v73.68,46.25
VS_MOSI  (via drill 0.6 pad 1.42)
  Top 0.254: U$1.11 53.4,49.52 55.57,51.69 62.96,51.69 65.53,49.12 v71.73,49.12 | U2.29 98.56,49.41 100.63,47.35 100.63,33.93 98.4,31.7 81.05,31.7 79.68,33.07 79.68,39.47 v77.62,41.53
  Bottom 0.254: v71.73,49.12 74.16,49.12 75.38,47.9 75.38,44.7 76.12,43.97 76.96,43.97 77.62,43.31 v77.62,41.53
VS_N$9
  Top 0.251: U2.18 91.57,42.1 | 91.57,42.1 91.57,39.26 92.2,38.63 92.2,37.59 | Y3.1 91.64,42.17 91.57,42.1
  Top 0.254: R35.2 92.17,37.63 92.2,37.59
  Top 0.406: C50.1 92.2,37.59
VS_N$13
  Top 0.251: U2.17 91.07,39.87 | 91.07,39.87 91.07,39.23 90.43,38.59 90.43,37.59 | Y3.3 91.06,39.87 91.07,39.87
  Top 0.254: R35.1 90.47,37.63 90.43,37.59
  Top 0.406: C49.1 90.43,37.59
VS_N$14
  Top 0.251: U2.46 90.07,55.4 88.82,56.64 88.82,59.59 89.67,60.44 R22.2
  Top 0.406: R22.2 R31.2
VS_N$15
  Top 0.251: U2.42 92.07,56.23 92.43,56.59 R23.2
VS_N$16
  Top 0.251: U2.39 93.57,56 95.49,57.93 R24.2
  Top 0.406: R24.2 95.49,60.11 95.98,60.6 95.98,62.05 R32.2
VS_N$17
  Top 0.251: U2.44 91.07,55.97 90.62,56.41 90.62,58.58 89.67,58.58 R25.2
VS_N$24
  Top 0.305: 97.17,59.51 R24.1
  Top 0.406: C33.2 97.17,59.51
VS_N$25
  Top 0.406: C36.2 R22.1
VS_N$26
  Top 0.251: U2.10 86.66,48.41 86.07,48.41 R29.1
VS_N$27
  Top 0.251: U2.9 84.85,48.91 R28.1
VS_N$28
  Top 0.251: U2.34 97.28,51.91 R27.1
VS_N$30
  Top 0.251: U2.33 98.55,51.41 R26.1
VS_N$34
  Top 0.251: U2.26 R30.1
VS_N$35
  Top 0.406: R31.1 C43.1
VS_N$36
  Top 0.406: R32.1 C44.1
VS_N$37
  Top 0.61: JP3.RING 96.88,67.29 95.99,66.41 R33.1 95.97,65.1 C44.2
VS_N$38
  Top 0.406: C43.2 89.67,65.14 R34.1
  Top 0.61: 89.67,65.14 89.67,66.28 88.66,67.29 JP3.TIP
VS_SCK  (via drill 0.6 pad 1.42)
  Top 0.254: U$1.10 53.8,49.13 55.8,51.13 62.73,51.13 65.88,47.98 v73.68,47.98 | U2.28 98.27,48.91 100.07,47.12 100.07,34.16 98.17,32.26 81.28,32.26 80.24,33.3 80.24,40.54 77.95,42.82 v76.48,42.82
  Bottom 0.254: v73.68,47.98 74.82,46.84 74.82,44.48 v76.48,42.82
VS_XCS
  Top 0.254: U$1.7 55,47.97 56.49,49.45 62.05,49.45 65.4,46.1 71.42,46.1 73,44.53 87.47,44.53 88.49,45.54 88.49,46.86 89.15,47.52 93.8,47.52 94.07,47.26 U2.23
VS_XDCS
  Top 0.254: U$1.6 55.4,47.58 56.71,48.9 61.82,48.9 65.17,45.54 71.19,45.54 72.77,43.97 87.7,43.97 89.07,45.33 U2.13
VS_XRST  (via drill 0.6 pad 1.42)
  Top 0.251: 85.62,53.65 85.59,53.67 81.35,53.67 80.87,53.19 v74.93,53.19
  Top 0.254: U$1.12 53,49.91 55.34,52.25 63.19,52.25 64.66,50.77 R36.1 | U2.3 86.41,51.91 86.05,52.27 86.05,53.21 85.62,53.65 | R36.1 v72.51,50.77 | R36.1
  Bottom 0.406: v72.51,50.77 v74.93,53.19